# EAGLE design PQ60-EPS (EAGLE 7.3.0)
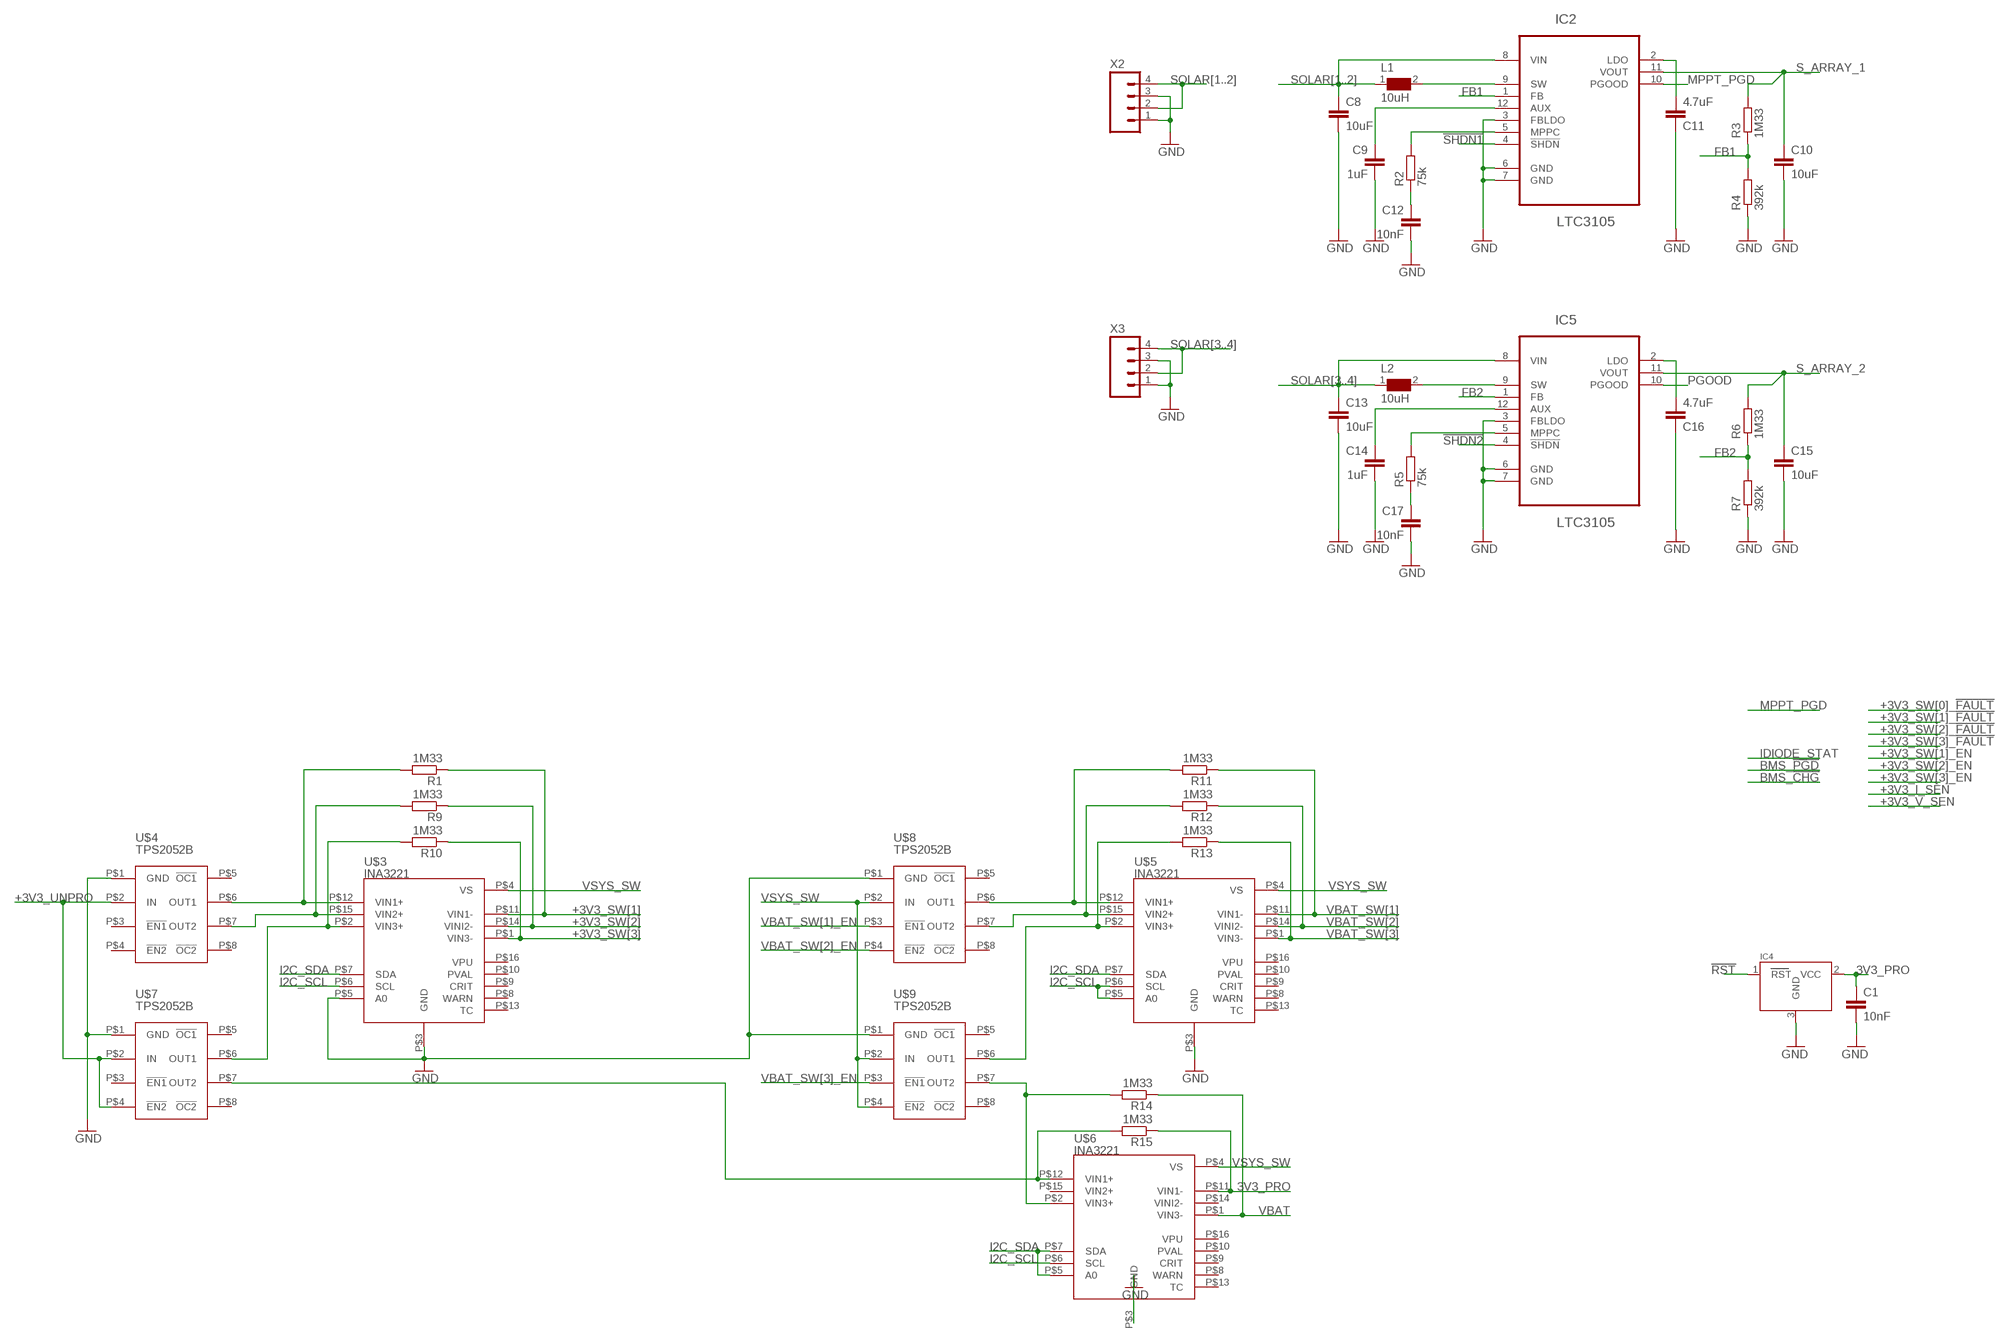
[diagram p0: schematic, sheet 1, part 1 of 2]
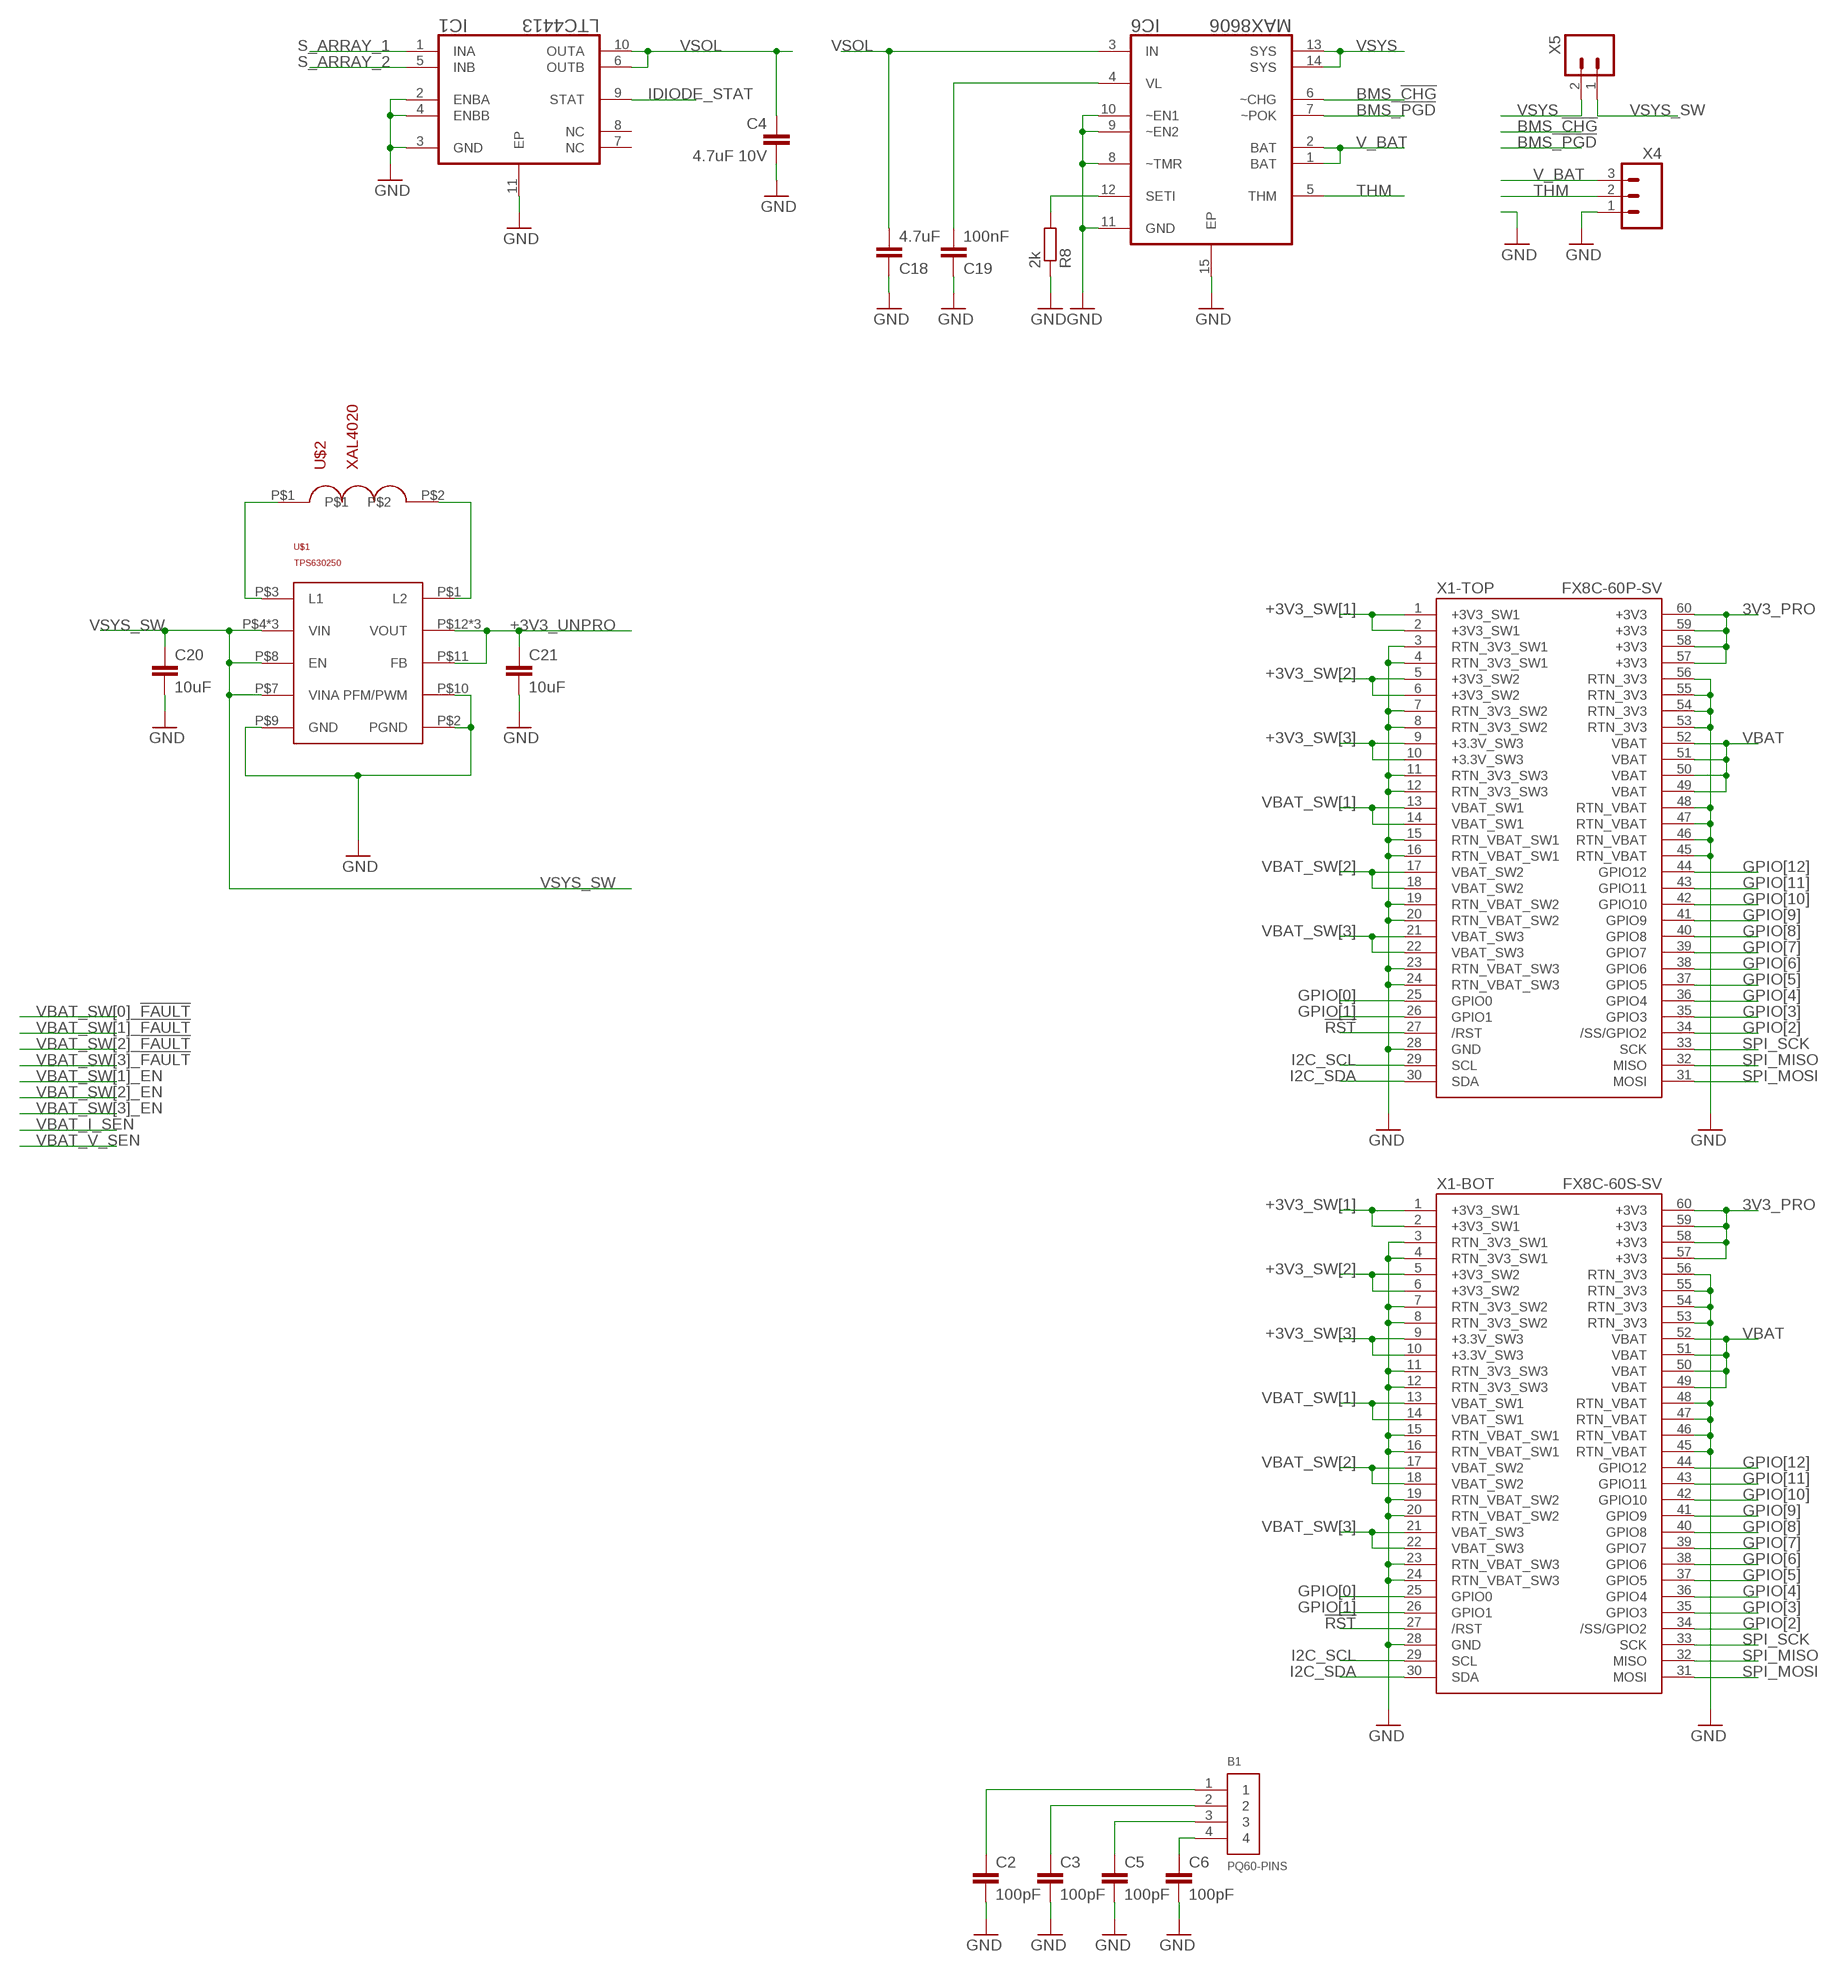
[diagram p1: schematic, sheet 1, part 2 of 2]

## Parts
B1  PQ60-PINS  [PQ60_PINS]
C1  10nF  C-EUC0603  [C0603]
C2  100pF  C-EUC0402  [C0402]
C3  100pF  C-EUC0402  [C0402]
C4  4.7uF 10V  C-EUC0805  [C0805]
C5  100pF  C-EUC0402  [C0402]
C6  100pF  C-EUC0402  [C0402]
C8  10uF  C-EUC0603  [C0603]
C9  1uF  C-EUC0603  [C0603]
C10  10uF  C-EUC0603  [C0603]
C11  4.7uF  C-EUC0603  [C0603]
C12  10nF  C-EUC0603  [C0603]
C13  10uF  C-EUC0603  [C0603]
C14  1uF  C-EUC0603  [C0603]
C15  10uF  C-EUC0603  [C0603]
C16  4.7uF  C-EUC0603  [C0603]
C17  10nF  C-EUC0603  [C0603]
C18  4.7uF  C-EUC0603  [C0603]
C19  100nF  C-EUC0603  [C0603]
C20  10uF  C-EUC0603  [C0603]
C21  10uF  C-EUC0603  [C0603]
IC1  LTC4413  LTC4413EDDPBF  [DFN300X300X80-11N]
IC2  LTC3105  LTC3105EMSPBF  [SOP65P490X110-12N]
IC4  MCP130TREFLOW  [SOT23-R]
IC5  LTC3105  LTC3105EMSPBF  [SOP65P490X110-12N]
IC6  MAX8606  MAX8606ETD+T  [DFN300X300X80-15N]
L1  10uH  WE-TPC-744031100_3816  [WE-TPC_3816]
L2  10uH  WE-TPC-744031100_3816  [WE-TPC_3816]
R1  1M33  R-EU_R0603  [R0603]
R2  75k  R-EU_R0603  [R0603]
R3  1M33  R-EU_R0603  [R0603]
R4  392k  R-EU_R0603  [R0603]
R5  75k  R-EU_R0603  [R0603]
R6  1M33  R-EU_R0603  [R0603]
R7  392k  R-EU_R0603  [R0603]
R8  2k  R-EU_R0603  [R0603]
R9  1M33  R-EU_R0603  [R0603]
R10  1M33  R-EU_R0603  [R0603]
R11  1M33  R-EU_R0603  [R0603]
R12  1M33  R-EU_R0603  [R0603]
R13  1M33  R-EU_R0603  [R0603]
R14  1M33  R-EU_R0603  [R0603]
R15  1M33  R-EU_R0603  [R0603]
U$1  TPS630250  [VQFN14]
U$2  XAL4020  [XAL4020]
U$3  INA3221  [VQFN16]
U$4  TPS2052B  [8SON]
U$5  INA3221  [VQFN16]
U$6  INA3221  [VQFN16]
U$7  TPS2052B  [8SON]
U$8  TPS2052B  [8SON]
U$9  TPS2052B  [8SON]
X1-BOT  FX8C-60S-SV  FX8C-60-R2S-SV  [FX8C-60S-SV]
X1-TOP  FX8C-60P-SV  FX8C-60-R2P-SV  [FX8C-60P-SV]
X2  M04SMD2  [1X04-1MM-RA]
X3  M04SMD2  [1X04-1MM-RA]
X4  M03SMD  [1X03-1MM-RA]
X5  M02SMD  [1X02-1MM-RA]

## Nets
3V3_PRO: C1.1 IC4.2(VCC) R15.1 U$6.P$11(VIN1-) X1-BOT.57(+3V3) X1-BOT.58(+3V3) X1-BOT.59(+3V3) X1-BOT.60(+3V3) X1-TOP.57(+3V3) X1-TOP.58(+3V3) X1-TOP.59(+3V3) X1-TOP.60(+3V3)
!RST: IC4.1(RST) X1-BOT.27(/RST) X1-TOP.27(/RST)
!SHDN1!: IC2.4(!SHDN!)
!SHDN2!: IC5.4(!SHDN!)
+3V3_SW[1]: R1.1 U$3.P$11(VIN1-) X1-BOT.1(+3V3_SW1) X1-BOT.2(+3V3_SW1) X1-TOP.1(+3V3_SW1) X1-TOP.2(+3V3_SW1)
+3V3_SW[2]: R9.1 U$3.P$14(VINI2-) X1-BOT.5(+3V3_SW2) X1-BOT.6(+3V3_SW2) X1-TOP.5(+3V3_SW2) X1-TOP.6(+3V3_SW2)
+3V3_SW[3]: R10.1 U$3.P$1(VIN3-) X1-BOT.9(+3.3V_SW3) X1-BOT.10(+3.3V_SW3) X1-TOP.9(+3.3V_SW3) X1-TOP.10(+3.3V_SW3)
+3V3_UNPRO: C21.1 U$1.P$11(FB) U$1.P$12(VOUT) U$1.P$13(VOUT) U$1.P$14(VOUT) U$4.P$2(IN) U$7.P$2(IN) U$7.P$4(!EN2!)
AUX1: C9.1 IC2.12(AUX)
AUX2: C14.1 IC5.12(AUX)
BATT_PROG: IC6.12(SETI) R8.2
BMS_!CHG!: IC6.6(~CHG)
BMS_!PGD!: IC6.7(~POK)
FB1: IC2.1(FB) R3.1 R4.2
FB2: IC5.1(FB) R6.1 R7.2
GND: C1.2 C2.2 C3.2 C4.2 C5.2 C6.2 C8.2 C9.2 C10.2 C11.1 C12.2 C13.2 C14.2 C15.2 C16.1 C17.2 C18.1 C19.1 C20.2 C21.2 IC1.2(ENBA) IC1.3(GND) IC1.4(ENBB) IC1.11(EP) IC2.3(FBLDO) IC2.6(GND) IC2.7(GND) IC4.3(GND) IC5.3(FBLDO) IC5.6(GND) IC5.7(GND) IC6.8(~TMR) IC6.9(~EN2) IC6.10(~EN1) IC6.11(GND) IC6.15(EP) R4.1 R7.1 R8.1 U$1.P$2(PGND) U$1.P$9(GND) U$1.P$10(PFM/PWM) U$3.P$3(GND) U$3.P$5(A0) U$4.P$1(GND) U$5.P$3(GND) U$6.P$3(GND) U$7.P$1(GND) U$8.P$1(GND) U$9.P$1(GND) X1-BOT.3(RTN_3V3_SW1) X1-BOT.4(RTN_3V3_SW1) X1-BOT.7(RTN_3V3_SW2) X1-BOT.8(RTN_3V3_SW2) X1-BOT.11(RTN_3V3_SW3) X1-BOT.12(RTN_3V3_SW3) X1-BOT.15(RTN_VBAT_SW1) X1-BOT.16(RTN_VBAT_SW1) X1-BOT.19(RTN_VBAT_SW2) X1-BOT.20(RTN_VBAT_SW2) X1-BOT.23(RTN_VBAT_SW3) X1-BOT.24(RTN_VBAT_SW3) X1-BOT.28(GND) X1-BOT.45(RTN_VBAT) X1-BOT.46(RTN_VBAT) X1-BOT.47(RTN_VBAT) X1-BOT.48(RTN_VBAT) X1-BOT.53(RTN_3V3) X1-BOT.54(RTN_3V3) X1-BOT.55(RTN_3V3) X1-BOT.56(RTN_3V3) X1-TOP.3(RTN_3V3_SW1) X1-TOP.4(RTN_3V3_SW1) X1-TOP.7(RTN_3V3_SW2) X1-TOP.8(RTN_3V3_SW2) X1-TOP.11(RTN_3V3_SW3) X1-TOP.12(RTN_3V3_SW3) X1-TOP.15(RTN_VBAT_SW1) X1-TOP.16(RTN_VBAT_SW1) X1-TOP.19(RTN_VBAT_SW2) X1-TOP.20(RTN_VBAT_SW2) X1-TOP.23(RTN_VBAT_SW3) X1-TOP.24(RTN_VBAT_SW3) X1-TOP.28(GND) X1-TOP.45(RTN_VBAT) X1-TOP.46(RTN_VBAT) X1-TOP.47(RTN_VBAT) X1-TOP.48(RTN_VBAT) X1-TOP.53(RTN_3V3) X1-TOP.54(RTN_3V3) X1-TOP.55(RTN_3V3) X1-TOP.56(RTN_3V3) X2.1 X2.3 X3.1 X3.3 X4.1
GPIO[0]: X1-BOT.25(GPIO0) X1-TOP.25(GPIO0)
GPIO[1]: X1-BOT.26(GPIO1) X1-TOP.26(GPIO1)
GPIO[2]: X1-BOT.34(/SS/GPIO2) X1-TOP.34(/SS/GPIO2)
GPIO[3]: X1-BOT.35(GPIO3) X1-TOP.35(GPIO3)
GPIO[4]: X1-BOT.36(GPIO4) X1-TOP.36(GPIO4)
GPIO[5]: X1-BOT.37(GPIO5) X1-TOP.37(GPIO5)
GPIO[6]: X1-BOT.38(GPIO6) X1-TOP.38(GPIO6)
GPIO[7]: X1-BOT.39(GPIO7) X1-TOP.39(GPIO7)
GPIO[8]: X1-BOT.40(GPIO8) X1-TOP.40(GPIO8)
GPIO[9]: X1-BOT.41(GPIO9) X1-TOP.41(GPIO9)
GPIO[10]: X1-BOT.42(GPIO10) X1-TOP.42(GPIO10)
GPIO[11]: X1-BOT.43(GPIO11) X1-TOP.43(GPIO11)
GPIO[12]: X1-BOT.44(GPIO12) X1-TOP.44(GPIO12)
I2C_SCL: U$3.P$6(SCL) U$5.P$5(A0) U$5.P$6(SCL) U$6.P$6(SCL) X1-BOT.29(SCL) X1-TOP.29(SCL)
I2C_SDA: U$3.P$7(SDA) U$5.P$7(SDA) U$6.P$5(A0) U$6.P$7(SDA) X1-BOT.30(SDA) X1-TOP.30(SDA)
IDIODE_STAT: IC1.9(STAT)
L1: U$1.P$3(L1) U$2.P$1
L2: U$1.P$1(L2) U$2.P$2
LDO1: C11.2 IC2.2(LDO)
LDO2: C16.2 IC5.2(LDO)
MPPC1: IC2.5(MPPC) R2.2
MPPC2: IC5.5(MPPC) R5.2
MPPT_PGD: IC2.10(PGOOD)
N$1: B1.1 C2.1
N$2: B1.2 C3.1
N$3: B1.3 C5.1
N$4: B1.4 C6.1
N$6: R1.2 U$3.P$12(VIN1+) U$4.P$6(OUT1)
N$7: R9.2 U$3.P$15(VIN2+) U$4.P$7(OUT2)
N$8: R10.2 U$3.P$2(VIN3+) U$7.P$6(OUT1)
N$9: R11.2 U$5.P$12(VIN1+) U$8.P$6(OUT1)
N$10: R12.2 U$5.P$15(VIN2+) U$8.P$7(OUT2)
N$11: R13.2 U$5.P$2(VIN3+) U$9.P$6(OUT1)
N$12: R14.2 U$6.P$2(VIN3+) U$9.P$7(OUT2)
N$13: R15.2 U$6.P$12(VIN1+) U$7.P$7(OUT2)
PGOOD: IC5.10(PGOOD)
S_ARRAY_1: C10.1 IC1.1(INA) IC2.11(VOUT) R3.2
S_ARRAY_2: C15.1 IC1.5(INB) IC5.11(VOUT) R6.2
SOLAR[1..2]: C8.1 IC2.8(VIN) L1.1 X2.2 X2.4
SOLAR[3..4]: C13.1 IC5.8(VIN) L2.1 X3.2 X3.4
SPI_MISO: X1-BOT.32(MISO) X1-TOP.32(MISO)
SPI_MOSI: X1-BOT.31(MOSI) X1-TOP.31(MOSI)
SPI_SCK: X1-BOT.33(SCK) X1-TOP.33(SCK)
SW1: IC2.9(SW) L1.2
SW2: IC5.9(SW) L2.2
THM: IC6.5(THM) X4.2
THM1: C12.1 R2.1
THM2: C17.1 R5.1
V_BAT: IC6.1(BAT) IC6.2(BAT) X4.3
VBAT: R14.1 U$6.P$1(VIN3-) X1-BOT.49(VBAT) X1-BOT.50(VBAT) X1-BOT.51(VBAT) X1-BOT.52(VBAT) X1-TOP.49(VBAT) X1-TOP.50(VBAT) X1-TOP.51(VBAT) X1-TOP.52(VBAT)
VBAT_SW[1]: R11.1 U$5.P$11(VIN1-) X1-BOT.13(VBAT_SW1) X1-BOT.14(VBAT_SW1) X1-TOP.13(VBAT_SW1) X1-TOP.14(VBAT_SW1)
VBAT_SW[1]_EN: U$8.P$3(!EN1!)
VBAT_SW[2]: R12.1 U$5.P$14(VINI2-) X1-BOT.17(VBAT_SW2) X1-BOT.18(VBAT_SW2) X1-TOP.17(VBAT_SW2) X1-TOP.18(VBAT_SW2)
VBAT_SW[2]_EN: U$8.P$4(!EN2!)
VBAT_SW[3]: R13.1 U$5.P$1(VIN3-) X1-BOT.21(VBAT_SW3) X1-BOT.22(VBAT_SW3) X1-TOP.21(VBAT_SW3) X1-TOP.22(VBAT_SW3)
VBAT_SW[3]_EN: U$9.P$3(!EN1!)
VL: C19.2 IC6.4(VL)
VSOL: C4.1 C18.2 IC1.6(OUTB) IC1.10(OUTA) IC6.3(IN)
VSYS: IC6.13(SYS) IC6.14(SYS) X5.2
VSYS_SW: C20.1 U$1.P$4(VIN) U$1.P$5(VIN) U$1.P$6(VIN) U$1.P$7(VINA) U$1.P$8(EN) U$3.P$4(VS) U$5.P$4(VS) U$6.P$4(VS) U$8.P$2(IN) U$9.P$2(IN) U$9.P$4(!EN2!) X5.1
Unconnected: IC1.7(NC) IC1.8(NC) U$3.P$8(WARN) U$3.P$9(CRIT) U$3.P$10(PVAL) U$3.P$13(TC) U$3.P$16(VPU) U$4.P$3(!EN1!) U$4.P$4(!EN2!) U$4.P$5(!OC1!) U$4.P$8(!OC2!) U$5.P$8(WARN) U$5.P$9(CRIT) U$5.P$10(PVAL) U$5.P$13(TC) U$5.P$16(VPU) U$6.P$8(WARN) U$6.P$9(CRIT) U$6.P$10(PVAL) U$6.P$13(TC) U$6.P$14(VINI2-) U$6.P$15(VIN2+) U$6.P$16(VPU) U$7.P$3(!EN1!) U$7.P$5(!OC1!) U$7.P$8(!OC2!) U$8.P$5(!OC1!) U$8.P$8(!OC2!) U$9.P$5(!OC1!) U$9.P$8(!OC2!)

## Library data of the parts
B1 = general:PQ60-PINS; OC_FARNELL: unknown
C1 C4 C8 C10-C13 C15-C21 = rcl:C-EU: CAPACITOR, European symbol; OC_FARNELL: unknown
C2 C3 C5 C6 = rcl:C-EU: CAPACITOR, European symbol; MF: AVX; MPN: 02013A101JAT2A; OC_FARNELL: 2280754
C9 C14 = rcl:C-EU: CAPACITOR, European symbol; MF: AVX; MPN: 02016D105MAT2A; OC_FARNELL: 1867951RL
IC1 = general:LTC4413EDDPBF: Dual 2.6A, 2.5V to 5.5V, Ideal Diodes; MF: LINEAR TECHNOLOGY; MPN: LTC4413EDD#PBF; OC_FARNELL: 1663736; OC_NEWARK: 56M9529; PACKAGE: DFN-10; SUPPLIER: Linear Technology
IC2 IC5 = general:LTC3105EMSPBF: DC/DC Converter; MF: LINEAR TECHNOLOGY; MPN: LTC3105EMS#PBF; OC_FARNELL: 1898601; OC_NEWARK: 27T5811; PACKAGE: MSOP-12; SUPPLIER: Linear Technology
IC4 = microbuilder:MCP130T: MCP130T Voltage Supervisor (Active Low) Voltage supervisors will put the MCU in a reset state if the voltage drops below a pre-determined level. SOT23-R/SOT23-W: Voltage Supervisor - 3.15V Active Low Note: Use the "Reflow" footprint when working with solder paste, and the "Wave" footprint when soldering by hand with a soldering iron (the latter has larger pads that are easier to solder by hand). Digikey: MCP130T-315I/TTCT-ND; OC_FARNELL: unknown
IC6 = general:MAX8606ETD+T: USB/AC Adapter, Li+ Linear Battery Charger with Integrated 50mÙ Battery Switch; MF: MAXIM INTEGRATED PRODUCTS; MPN: MAX8606ETD+T; OC_FARNELL: 1628234; OC_NEWARK: 68K5050; PACKAGE: DFN-14; SUPPLIER: Maxim
L1 L2 = WE-TPC:WE-TPC: Shielded Tiny Power Inductor WE-TPC - Extremely flat power inductor - High current capability - High reliability and perfect soldering characteristics because of integrated soldering pad - magnetically shielded -- Portable power like PDA, digital camera, PCMICA-cards and displays -- DC/DC-converter -- Recommended for switching regulator IC's from Linear Technology, National Semiconductor, Texas Instruments and Fairchild Semiconductor; MF: WURTH ELEKTRONIK; MPN: 744031100; OC_FARNELL: 1635835; OC_NEWARK: 08P2474; PACKAGE: 3816; SUPPLIER: WURTH ELEKTRONIK
R1-R15 = rcl:R-EU_: RESISTOR, European symbol; OC_FARNELL: unknown
U$1 = ears-pq:TPS630250
U$2 = ears-pq:XAL4020
U$3 U$5 U$6 = ears-pq:INA3221
U$4 U$7-U$9 = ears-pq:TPS2052B
X1-BOT X1-TOP = PQ60:FX8C-60-R2; OC_FARNELL: unknown
X2 X3 = SparkFun-Connectors:M04: Header 4 Standard 4-pin 0.1" header. Use with straight break away headers (SKU : PRT-00116), right angle break away headers (PRT-00553), swiss pins (PRT-00743), machine pins (PRT-00117), and female headers (PRT-00115). Molex polarized connector foot print use with SKU : PRT-08231 with associated crimp pins and housings. 1MM SMD Version SKU: PRT-10208; OC_FARNELL: unknown
X4 = SparkFun-Connectors:M03: Header 3 Standard 3-pin 0.1" header. Use with straight break away headers (SKU : PRT-00116), right angle break away headers (PRT-00553), swiss pins (PRT-00743), machine pins (PRT-00117), and female headers (PRT-00115). Molex polarized connector foot print use with SKU : PRT-08232 with associated crimp pins and housings.; OC_FARNELL: unknown
X5 = SparkFun-Connectors:M02: Standard 2-pin 0.1" header. Use with - straight break away headers ( PRT-00116) - right angle break away headers (PRT-00553) - swiss pins (PRT-00743) - machine pins (PRT-00117) - female headers (PRT-00115) Molex polarized connector foot print use with: PRT-08233 with associated crimp pins and housings. 2.54_SCREWTERM for use with PRT-10571. 3.5mm Screw Terminal footprints for PRT-08084 5mm Screw Terminal footprints for use with PRT-08432; OC_FARNELL: unknown

## Module MPPT
Ports: GND(pwr) VOUT(out) VIN(in) THM(in) PGOOD(out) !SHDN!(in)
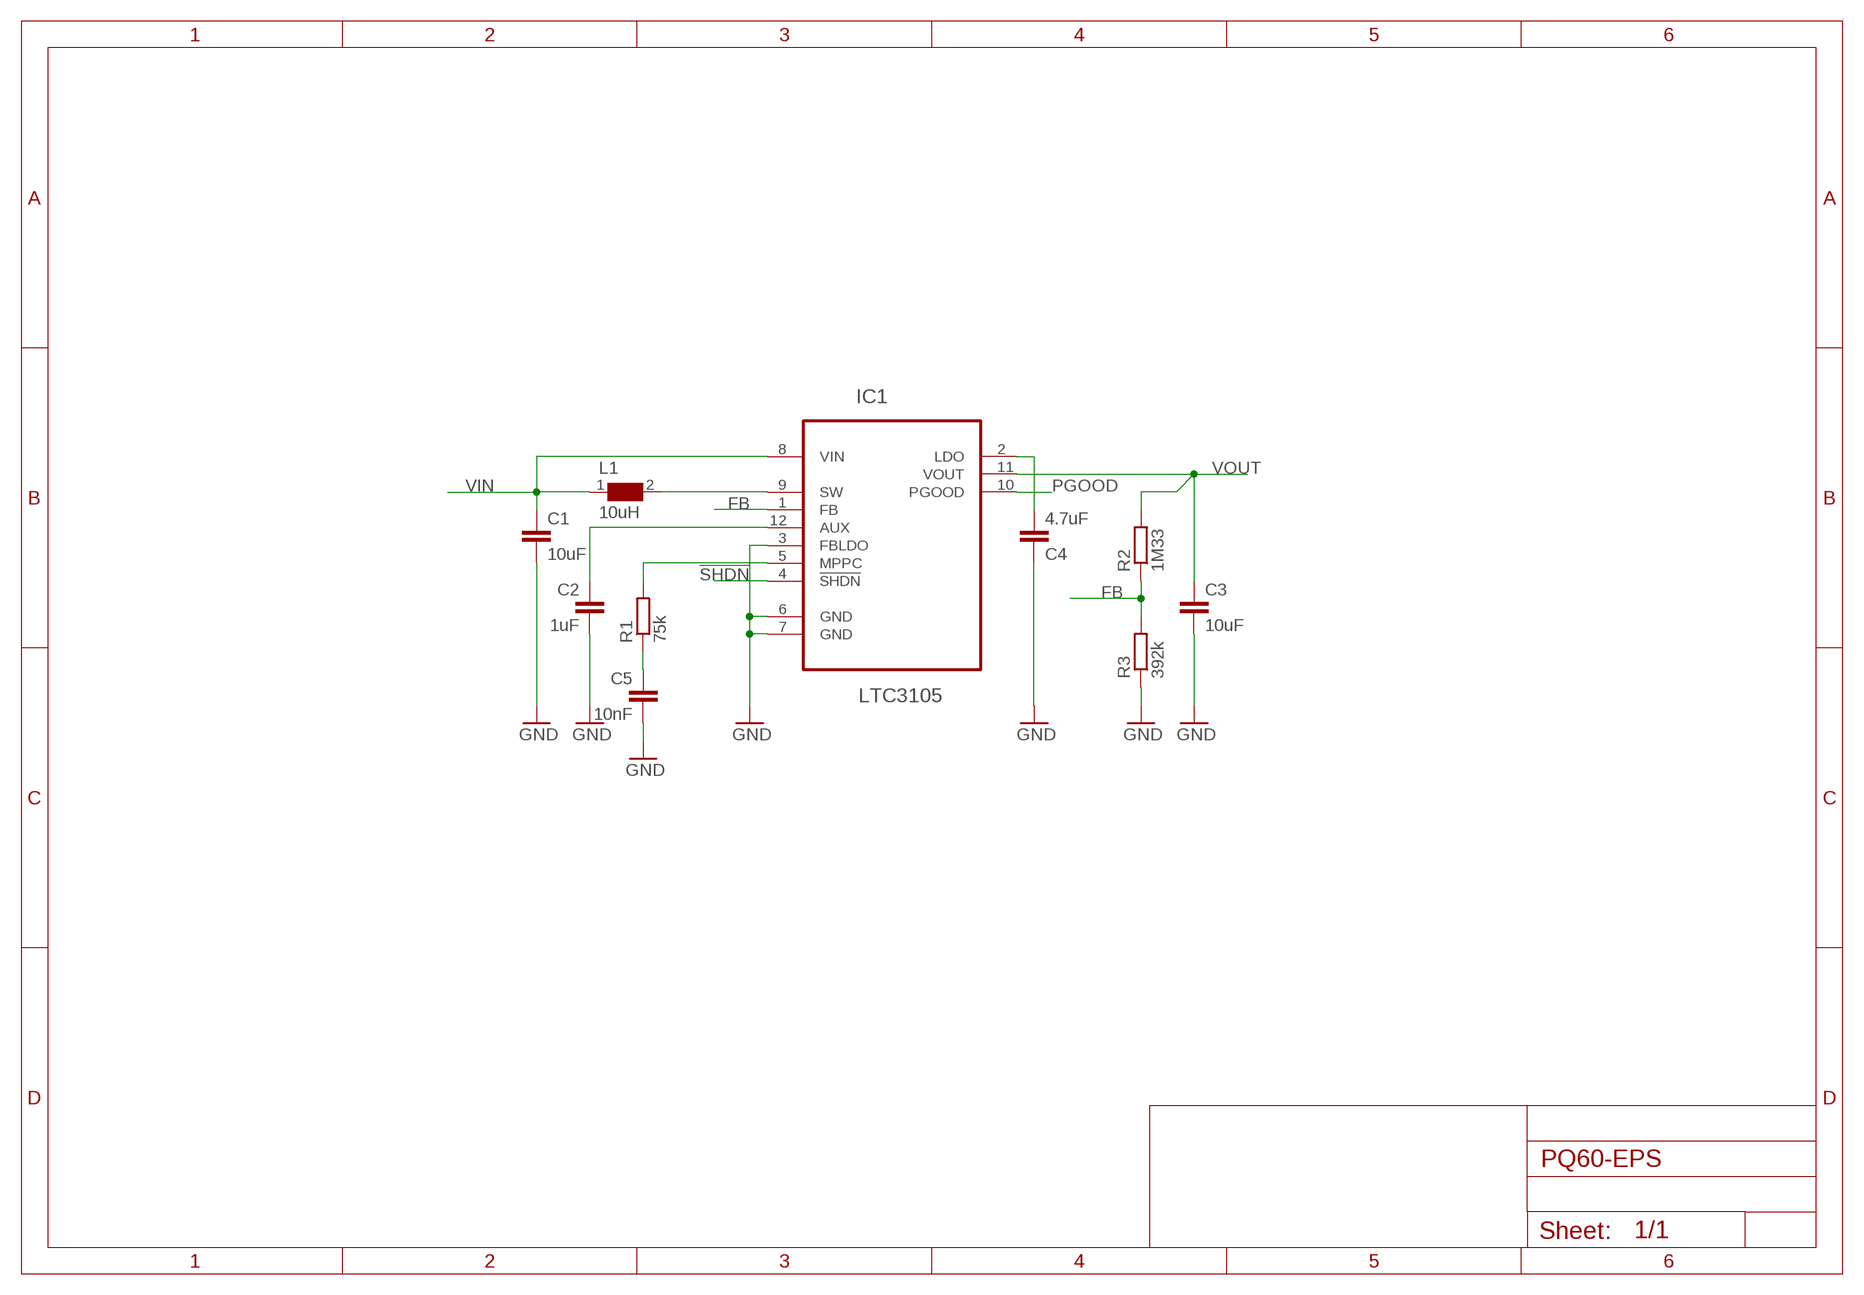
[diagram p2: schematic, module MPPT, sheet 1]

### Parts
C1  10uF  C-EUC0603  [C0603]
C2  1uF  C-EUC0603  [C0603]
C3  10uF  C-EUC0603  [C0603]
C4  4.7uF  C-EUC0603  [C0603]
C5  10nF  C-EUC0603  [C0603]
IC1  LTC3105  LTC3105EMSPBF  [SOP65P490X110-12N]
L1  10uH  WE-TPC-744031100_3816  [WE-TPC_3816]
R1  75k  R-EU_R0603  [R0603]
R2  1M33  R-EU_R0603  [R0603]
R3  392k  R-EU_R0603  [R0603]

### Nets
!SHDN!: IC1.4(!SHDN!)
AUX: C2.1 IC1.12(AUX)
FB: IC1.1(FB) R2.1 R3.2
GND: C1.2 C2.2 C3.2 C4.1 C5.2 IC1.3(FBLDO) IC1.6(GND) IC1.7(GND) R3.1
LDO: C4.2 IC1.2(LDO)
MPPC: IC1.5(MPPC) R1.2
PGOOD: IC1.10(PGOOD)
SW: IC1.9(SW) L1.2
THM: C5.1 R1.1
VIN: C1.1 IC1.8(VIN) L1.1
VOUT: C3.1 IC1.11(VOUT) R2.2

### Library data of the parts
C1 C3-C5 = rcl:C-EU: CAPACITOR, European symbol; OC_FARNELL: unknown
C2 = rcl:C-EU: CAPACITOR, European symbol; MF: AVX; MPN: 02016D105MAT2A; OC_FARNELL: 1867951RL
IC1 = general:LTC3105EMSPBF: DC/DC Converter; MF: LINEAR TECHNOLOGY; MPN: LTC3105EMS#PBF; OC_FARNELL: 1898601; OC_NEWARK: 27T5811; PACKAGE: MSOP-12; SUPPLIER: Linear Technology
L1 = WE-TPC:WE-TPC: Shielded Tiny Power Inductor WE-TPC - Extremely flat power inductor - High current capability - High reliability and perfect soldering characteristics because of integrated soldering pad - magnetically shielded -- Portable power like PDA, digital camera, PCMICA-cards and displays -- DC/DC-converter -- Recommended for switching regulator IC's from Linear Technology, National Semiconductor, Texas Instruments and Fairchild Semiconductor; MF: WURTH ELEKTRONIK; MPN: 744031100; OC_FARNELL: 1635835; OC_NEWARK: 08P2474; PACKAGE: 3816; SUPPLIER: WURTH ELEKTRONIK
R1-R3 = rcl:R-EU_: RESISTOR, European symbol; OC_FARNELL: unknown

## Module SMPS
Ports: VIN(in) VOUT(out) GND(pwr) !SHDN(in)
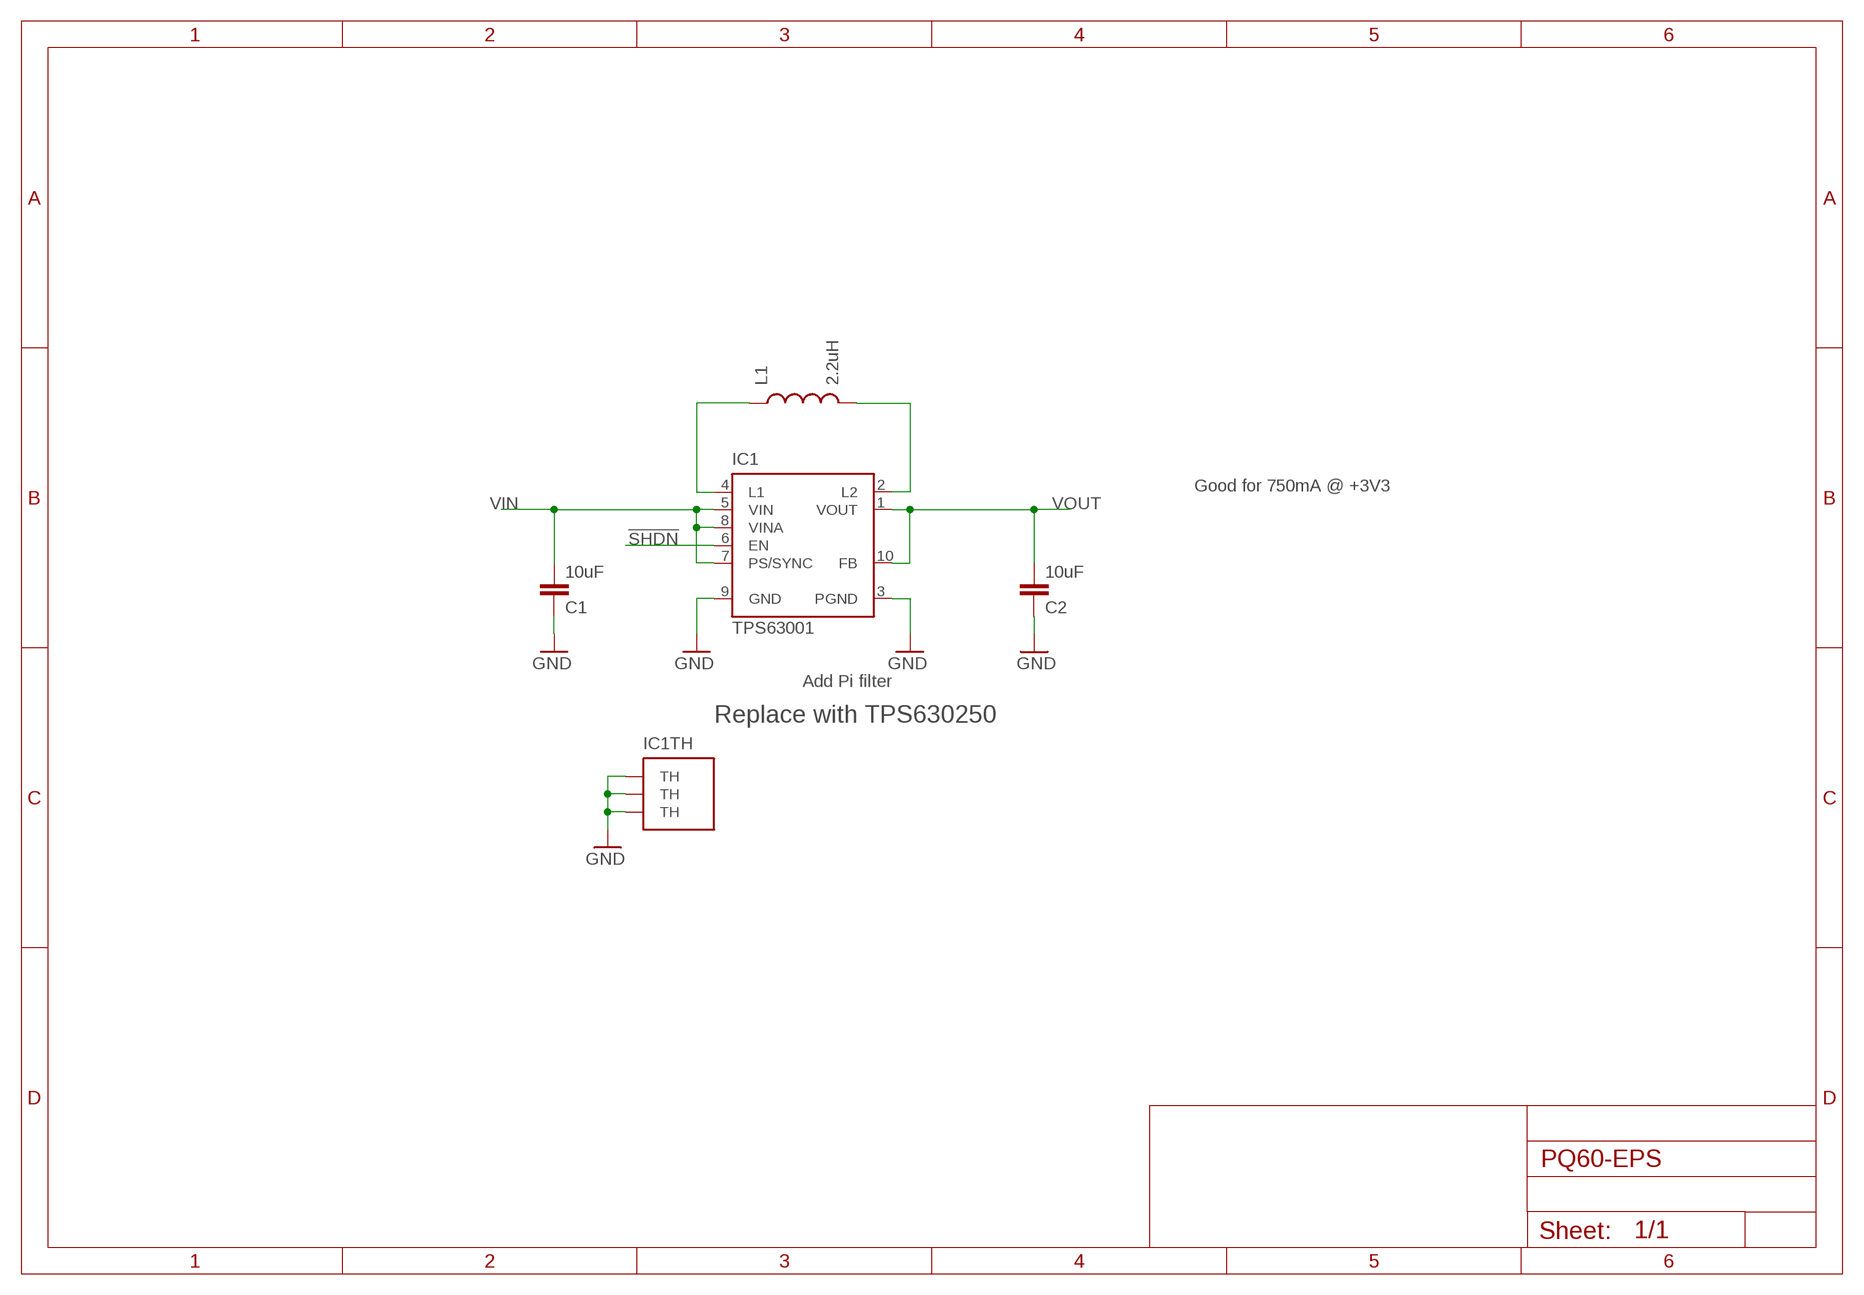
[diagram p3: schematic, module SMPS, sheet 1]

### Parts
C1  10uF  C-EUC0805  [C0805]
C2  10uF  C-EUC0805  [C0805]
IC1  TPS63001  TPS6300  [DRC-S-PVSON-N10]
L1  2.2uH  INDUCTORVLF4012A  [VLF4012A]

### Nets
!SHDN: IC1.6(EN)
GND: C1.1 C2.1 IC1.3(PGND) IC1.9(GND) IC1.TH IC1.TH@1(TH) IC1.TH@2(TH)
N$1: IC1.4(L1) L1.P$1
N$2: IC1.2(L2) L1.P$2
VIN: C1.2 IC1.5(VIN) IC1.7(PS/SYNC) IC1.8(VINA)
VOUT: C2.2 IC1.1(VOUT) IC1.10(FB)

### Notes on the sheet
- Good for 750mA @ +3V3
- Add Pi filter
- Replace with TPS630250

### Library data of the parts
C1 C2 = rcl:C-EU: CAPACITOR, European symbol; OC_FARNELL: unknown
IC1 = texas:TPS6300*: HIGH EFFICIENT SINGLE INDUCTOR BUCK-BOOST CONVERTER WITH 1.8-A SWITCHES Source: http://focus.ti.com/lit/ds/symlink/tps63001.pdf; MF: TEXAS INSTRUMENTS; MPN: TPS63001DRCT; OC_FARNELL: 1652399
L1 = SparkFun-Passives:INDUCTOR: Inductors Basic Inductor/Choke - 0603 and 1206. Footprints are not proven and vary greatly between part numbers. SRN6045- 33uH, 20% 1.4A SDR0403-560KL - 56uH, 10%, 500mA RMS/740mA peak; MF: TDK; MPN: VLF4012AT-2R2M1R5; OC_FARNELL: 1670126

## Module IDIODE
Ports: GND(pwr) VOUT(out) STAT1(out) STAT2(out) VIN1(in) VIN2(in) VIN3(in) VIN4(in)

### Library data of the parts

## Module BMS
Ports: GND(pwr) VIN(in) VOUT(out) VBAT(out) THM(in) !CHG(out) !PGD(out)
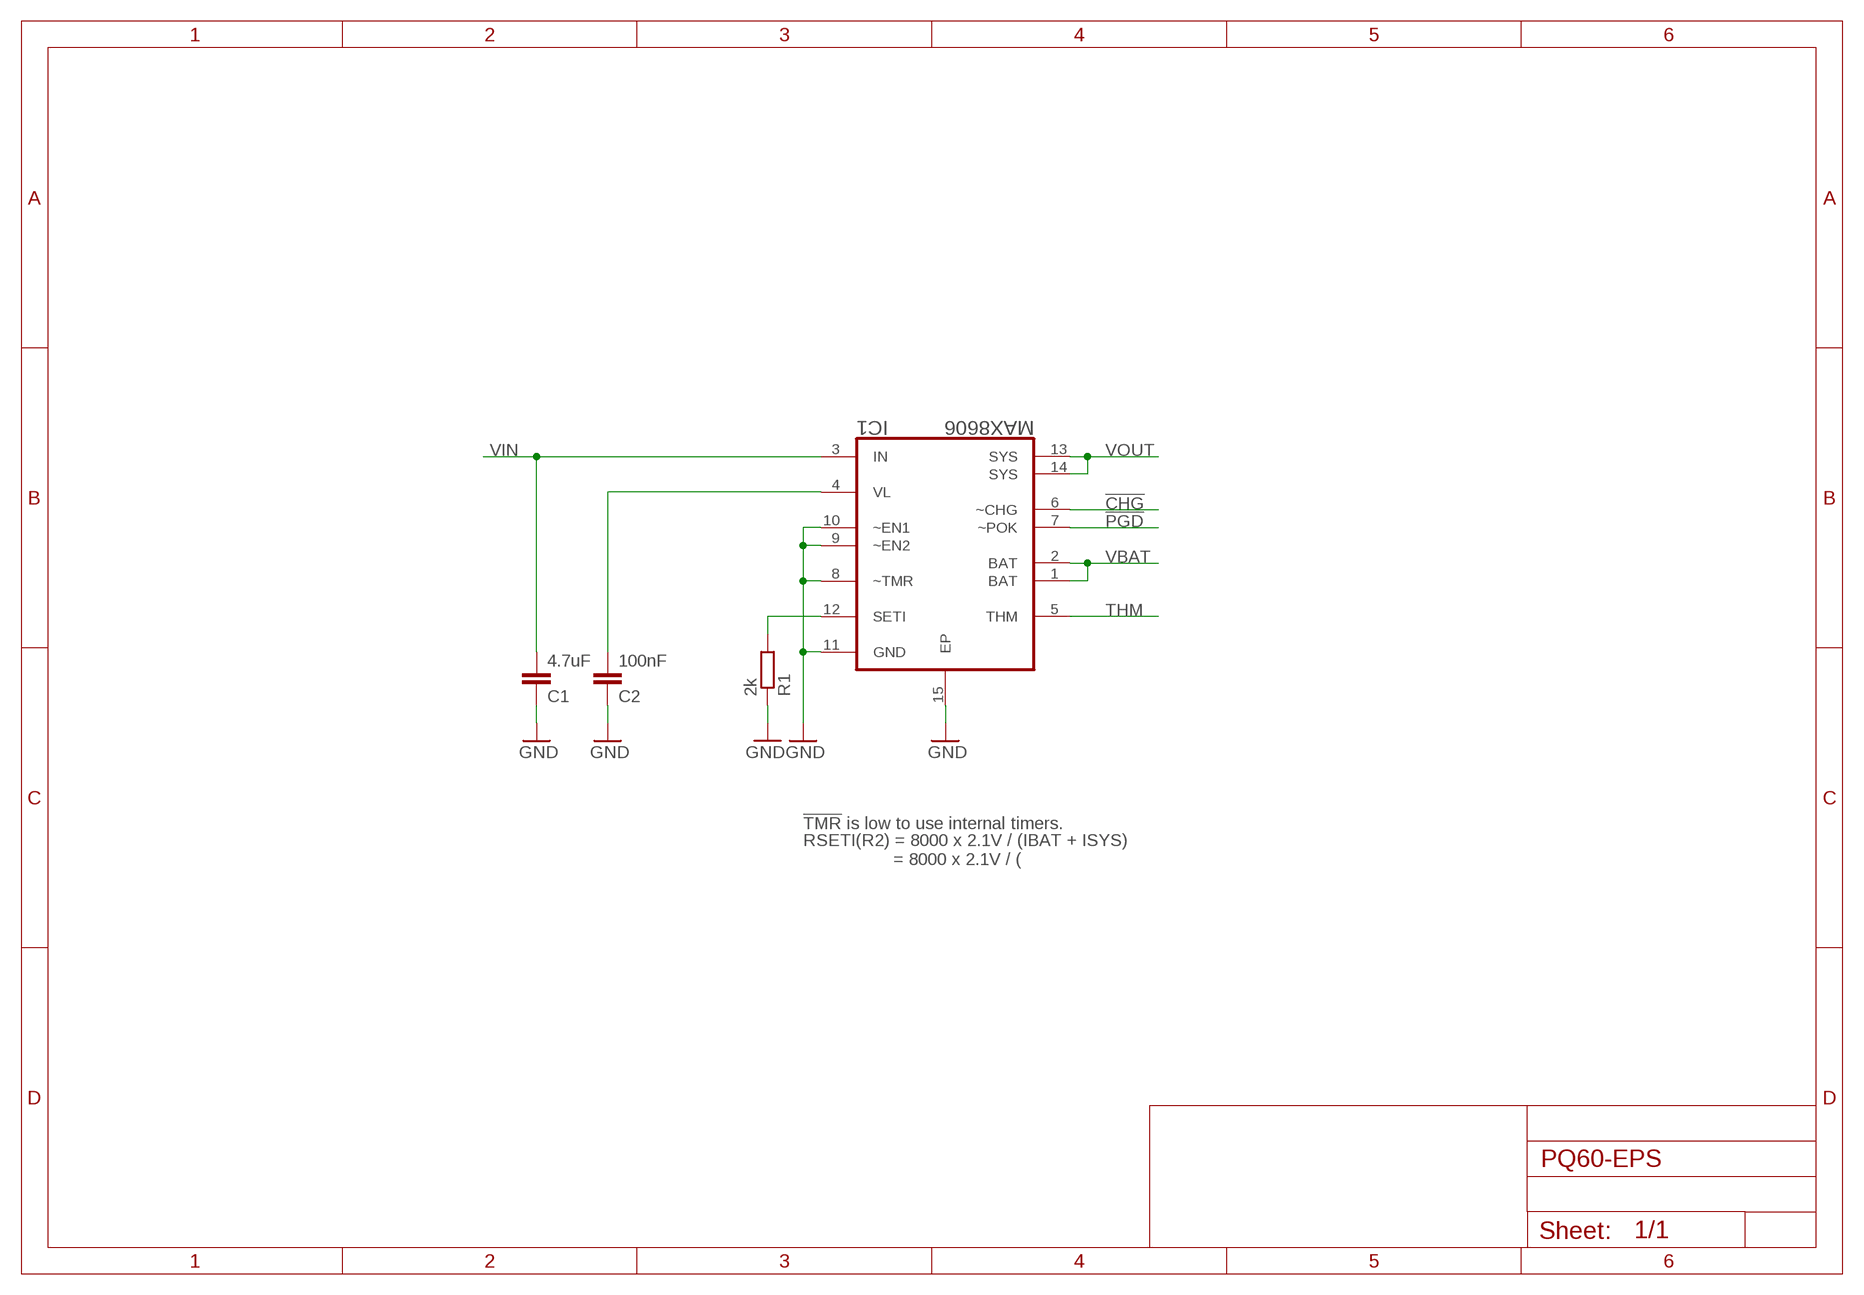
[diagram p4: schematic, module BMS, sheet 1]

### Parts
C1  4.7uF  C-EUC0603  [C0603]
C2  100nF  C-EUC0603  [C0603]
IC1  MAX8606  MAX8606ETD+T  [DFN300X300X80-15N]
R1  2k  R-EU_R0603  [R0603]

### Nets
!CHG: IC1.6(~CHG)
!PGD: IC1.7(~POK)
BATT_PROG: IC1.12(SETI) R1.2
GND: C1.1 C2.1 IC1.8(~TMR) IC1.9(~EN2) IC1.10(~EN1) IC1.11(GND) IC1.15(EP) R1.1
THM: IC1.5(THM)
VBAT: IC1.1(BAT) IC1.2(BAT)
VIN: C1.2 IC1.3(IN)
VL: C2.2 IC1.4(VL)
VOUT: IC1.13(SYS) IC1.14(SYS)

### Notes on the sheet
- !TMR! is low to use internal timers.
- RSETI(R2) = 8000 x 2.1V / (IBAT + ISYS)
                    = 8000 x 2.1V / (

### Library data of the parts
C1 C2 = rcl:C-EU: CAPACITOR, European symbol; OC_FARNELL: unknown
IC1 = general:MAX8606ETD+T: USB/AC Adapter, Li+ Linear Battery Charger with Integrated 50mÙ Battery Switch; MF: MAXIM INTEGRATED PRODUCTS; MPN: MAX8606ETD+T; OC_FARNELL: 1628234; OC_NEWARK: 68K5050; PACKAGE: DFN-14; SUPPLIER: Maxim
R1 = rcl:R-EU_: RESISTOR, European symbol; OC_FARNELL: unknown

## Module PROT
Ports: IN(in) OUT(out) V_SEN(out) I_SEN(out) GND(pwr) OUT_!FAULT!(out) SW1_!FAULT!(out) SW2_!FAULT!(out) SW3_!FAULT!(out) OUT_SW1(out) OUT_SW2(out) OUT_SW3(out) SW1_EN(in) SW2_EN(in) SW3_EN(in)
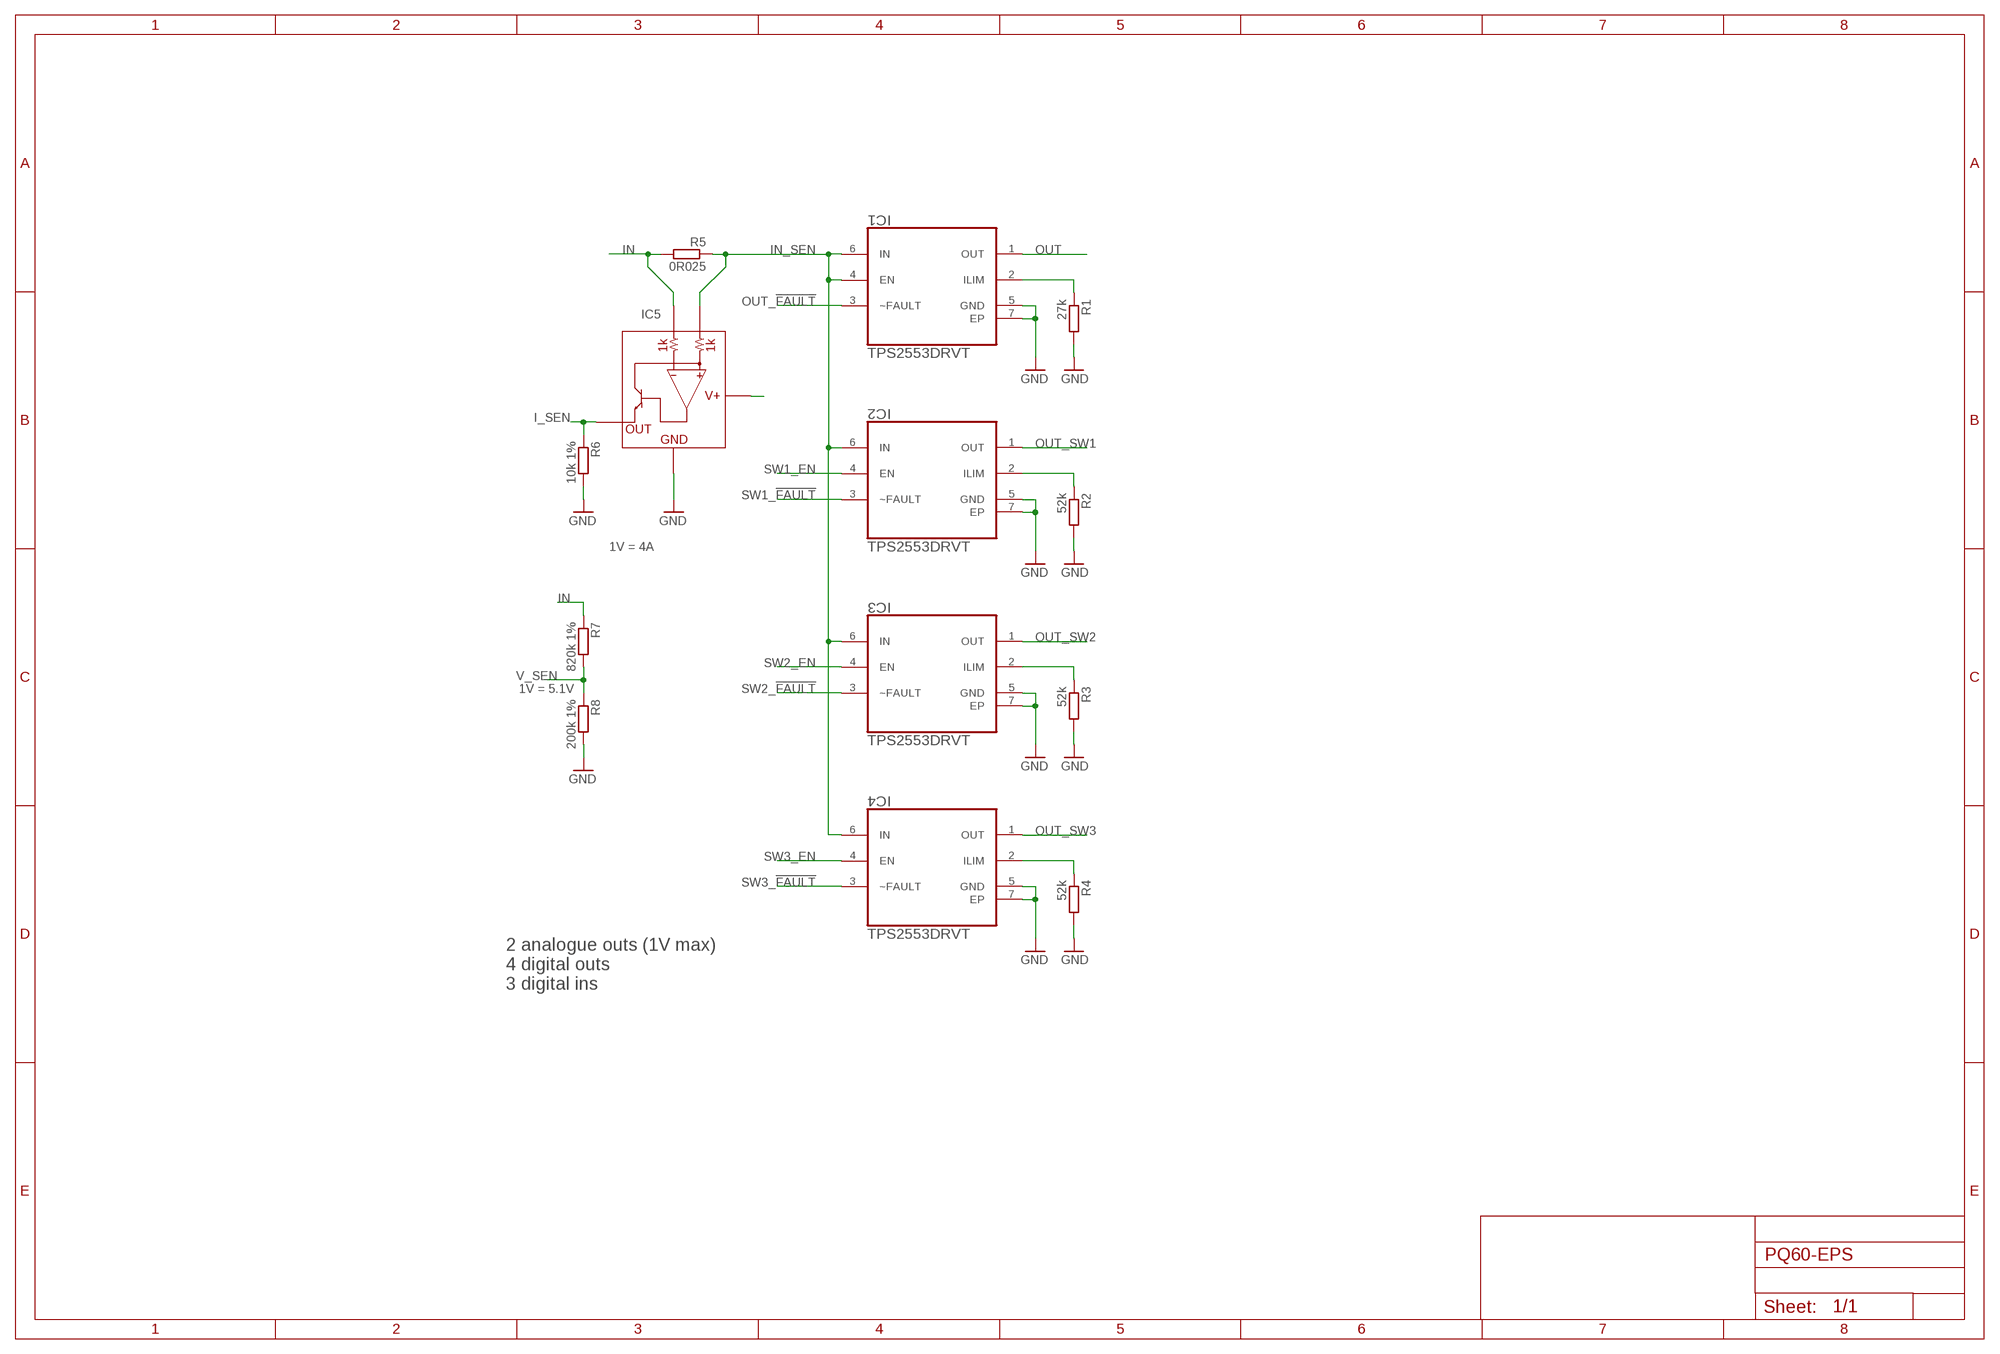
[diagram p5: schematic, module PROT, sheet 1]

### Parts
IC1  TPS2553DRVT  [SON65P200X200X80-7N]
IC2  TPS2553DRVT  [SON65P200X200X80-7N]
IC3  TPS2553DRVT  [SON65P200X200X80-7N]
IC4  TPS2553DRVT  [SON65P200X200X80-7N]
IC5  INA139  [SOT23-5]
R1  27k  R-EU_R0603  [R0603]
R2  52k  R-EU_R0603  [R0603]
R3  52k  R-EU_R0603  [R0603]
R4  52k  R-EU_R0603  [R0603]
R5  0R025  R-EU_R1206  [R1206]
R6  10k 1%  R-EU_R0603  [R0603]
R7  820k 1%  R-EU_R0603  [R0603]
R8  200k 1%  R-EU_R0603  [R0603]

### Nets
GND: IC1.5(GND) IC1.7(EP) IC2.5(GND) IC2.7(EP) IC3.5(GND) IC3.7(EP) IC4.5(GND) IC4.7(EP) IC5.2(GND) R1.2 R2.2 R3.2 R4.2 R6.2 R8.2
I_LIM_SW1: IC2.2(ILIM) R2.1
I_LIM_SW2: IC3.2(ILIM) R3.1
I_LIM_SW3: IC4.2(ILIM) R4.1
I_LIM_VCC: IC1.2(ILIM) R1.1
I_SEN: IC5.1(OUT) R6.1
IN: IC5.4(VIN-) IC5.5(V+) R5.2 R7.1
IN_SEN: IC1.4(EN) IC1.6(IN) IC2.6(IN) IC3.6(IN) IC4.6(IN) IC5.3(VIN+) R5.1
OUT: IC1.1(OUT)
OUT_!FAULT!: IC1.3(~FAULT)
OUT_SW1: IC2.1(OUT)
OUT_SW2: IC3.1(OUT)
OUT_SW3: IC4.1(OUT)
SW1_!FAULT!: IC2.3(~FAULT)
SW1_EN: IC2.4(EN)
SW2_!FAULT!: IC3.3(~FAULT)
SW2_EN: IC3.4(EN)
SW3_!FAULT!: IC4.3(~FAULT)
SW3_EN: IC4.4(EN)
V_SEN: R7.2 R8.1

### Notes on the sheet
- 1V = 4A
- 1V = 5.1V
- 2 analogue outs (1V max)
  4 digital outs
  3 digital ins

### Library data of the parts
IC1-IC4 = general:TPS2553DRVT: POWER-DISTRIBUTION SWITCHES; MF: TEXAS INSTRUMENTS; MPN: TPS2553DRVT; OC_FARNELL: 1694427; OC_NEWARK: 40P3872; PACKAGE: SON-6; SUPPLIER: TEXAS INSTRUMENTS
IC5 = SparkFun-AnalogIC:INA139: High-side shunt current sense 2.7V-40V, 1%; OC_FARNELL: unknown
R1-R8 = rcl:R-EU_: RESISTOR, European symbol; OC_FARNELL: unknown

## Board
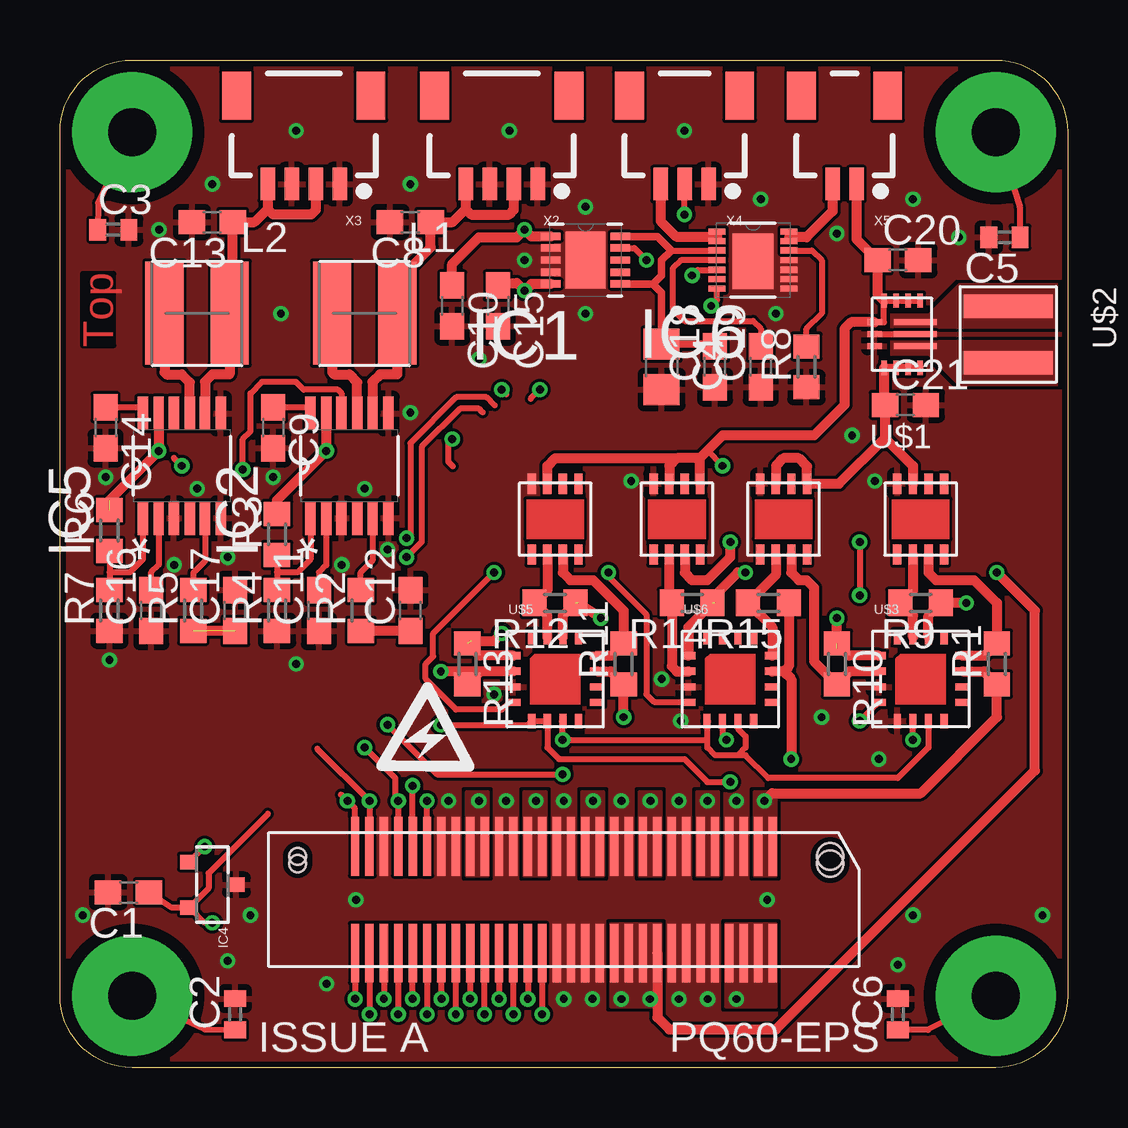
[diagram p6: board, top side]
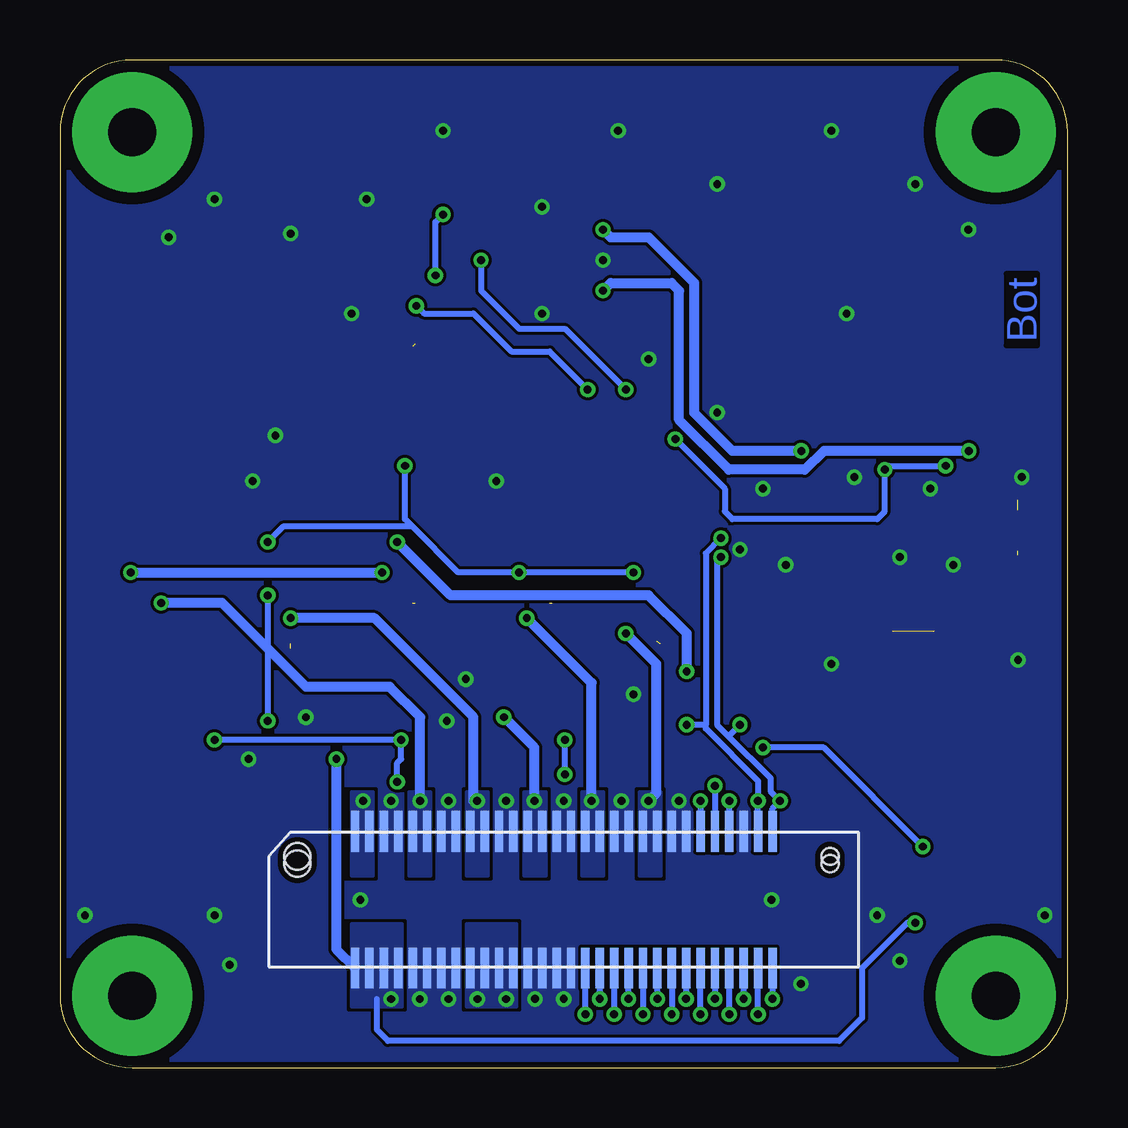
[diagram p7: board, bottom side, seen from below]

Size 42 x 42 mm. Coordinates in mm from the lower left corner, seen from the top.
Copper layers (1*16): Top 0.035mm / dielectric 1.5mm / Bottom 0.035mm
Design rules "dirt_cheap_dirty_boards.v1": minimum track width 5mil, minimum drill 12mil, track to track 5mil, track to pad 5mil, pad to pad 5mil, via to via 5mil, smd to smd 0mil, copper to edge 10mil, drill to drill 10mil, minimum pad ring 10mil, minimum via ring 6mil, stop-mask expansion 2mil, vias tented up to drill 25mil, thermal gap 10mil

### Footprints (pad centres in the part's own frame; a part is rotated, then mirrored left to right if it is on the bottom)
PQ60_PINS = drill 2 pad 5: 1 3,3; 2 3,39; 3 39,39; 4 39,3
C0603 = smd 1.1 x 1: 1 -0.85,0; 2 0.85,0
C0402 = smd 0.7 x 0.9: 1 -0.65,0; 2 0.65,0
C0805 = smd 1.3 x 1.5: 1 -0.95,0; 2 0.95,0
DFN300X300X80-11N = smd 0.813 x 0.305: 1 -1.448,0.991; 2 -1.448,0.508; 3 -1.448,0; 4 -1.448,-0.508; 5 -1.448,-0.991; 6 1.448,-0.991; 7 1.448,-0.508; 8 1.448,0; 9 1.448,0.508; 10 1.448,0.991 | smd 1.651 x 2.388: 11 0,0
SOP65P490X110-12N = smd 1.397 x 0.432: 1 -2.184,1.626; 2 -2.184,0.965; 3 -2.184,0.33; 4 -2.184,-0.33; 5 -2.184,-0.965; 6 -2.184,-1.626; 7 2.184,-1.626; 8 2.184,-0.965; 9 2.184,-0.33; 10 2.184,0.33; 11 2.184,0.965; 12 2.184,1.626
SOT23-R = smd 0.6 x 0.7: 1 -0.95,-1; 2 0.95,-1; 3 0,1
DFN300X300X80-15N = smd 0.711 x 0.254: 1 -1.499,1.194; 2 -1.499,0.787; 3 -1.499,0.406; 4 -1.499,0; 5 -1.499,-0.406; 6 -1.499,-0.787; 7 -1.499,-1.194; 8 1.499,-1.194; 9 1.499,-0.787; 10 1.499,-0.406; 11 1.499,0; 12 1.499,0.406; 13 1.499,0.787; 14 1.499,1.194 | smd 1.702 x 2.311: 15 0,-0.051
WE-TPC_3816 = smd 1.6 x 4.3: 1 -1.356,-0.014; 2 1.356,-0.014
R0603 = smd 1 x 1.1: 1 -0.85,0; 2 0.85,0
VQFN14 = smd 1.79 x 0.24: P$1 0.695,2; P$2 0.695,1.5; P$3 0.695,1 | smd 0.24 x 0.6: P$4 0.5,0.1; P$5 1,0.1; P$6 1.5,0.1; P$7 2,0.1; P$11 2,2.9; P$12 1.5,2.9; P$13 1,2.9; P$14 0.5,2.9 | smd 0.6 x 0.24: P$8 2.4,1; P$9 2.4,1.5; P$10 2.4,2
XAL4020 = smd 0.98 x 3.7: P$1 -1.175,0; P$2 1.175,0
VQFN16 = smd 0.6 x 0.3: P$1 -1.75,0.975; P$2 -1.75,0.325; P$3 -1.75,-0.325; P$4 -1.75,-0.975; P$9 1.75,-0.975; P$10 1.75,-0.325; P$11 1.75,0.325; P$12 1.75,0.975 | smd 0.3 x 0.6: P$5 -0.975,-1.75; P$6 -0.325,-1.75; P$7 0.325,-1.75; P$8 0.975,-1.75; P$13 0.975,1.75; P$14 0.325,1.75; P$15 -0.325,1.75; P$16 -0.975,1.75
8SON = smd 0.35 x 0.85: P$1 -0.975,1.475; P$2 -0.325,1.475; P$3 0.325,1.475; P$4 0.975,1.475; P$5 0.975,-1.475; P$6 0.325,-1.475; P$7 -0.325,-1.475; P$8 -0.975,-1.475
FX8C-60S-SV = smd 0.35 x 1.7: 1 -8.7,2.85; 2 -8.1,2.85; 3 -7.5,2.85; 4 -6.9,2.85; 5 -6.3,2.85; 6 -5.7,2.85; 7 -5.1,2.85; 8 -4.5,2.85; 9 -3.9,2.85; 10 -3.3,2.85; 11 -2.7,2.85; 12 -2.1,2.85; 13 -1.5,2.85; 14 -0.9,2.85; 15 -0.3,2.85; 16 0.3,2.85; 17 0.9,2.85; 18 1.5,2.85; 19 2.1,2.85; 20 2.7,2.85; 21 3.3,2.85; 22 3.9,2.85; 23 4.5,2.85; 24 5.1,2.85; 25 5.7,2.85; 26 6.3,2.85; 27 6.9,2.85; 28 7.5,2.85; 29 8.1,2.85; 30 8.7,2.85; 31 8.7,-2.85; 32 8.1,-2.85; 33 7.5,-2.85; 34 6.9,-2.85; 35 6.3,-2.85; 36 5.7,-2.85; 37 5.1,-2.85; 38 4.5,-2.85; 39 3.9,-2.85; 40 3.3,-2.85; 41 2.7,-2.85; 42 2.1,-2.85; 43 1.5,-2.85; 44 0.9,-2.85; 45 0.3,-2.85; 46 -0.3,-2.85; 47 -0.9,-2.85; 48 -1.5,-2.85; 49 -2.1,-2.85; 50 -2.7,-2.85; 51 -3.3,-2.85; 52 -3.9,-2.85; 53 -4.5,-2.85; 54 -5.1,-2.85; 55 -5.7,-2.85; 56 -6.3,-2.85; 57 -6.9,-2.85; 58 -7.5,-2.85; 59 -8.1,-2.85; 60 -8.7,-2.85 | hole 1.1: -11.1,1.8 | hole 0.7: 11.1,1.8
FX8C-60P-SV = smd 0.35 x 2.45: 1 -8.7,-2.225; 2 -8.1,-2.225; 3 -7.5,-2.225; 4 -6.9,-2.225; 5 -6.3,-2.225; 6 -5.7,-2.225; 7 -5.1,-2.225; 8 -4.5,-2.225; 9 -3.9,-2.225; 10 -3.3,-2.225; 11 -2.7,-2.225; 12 -2.1,-2.225; 13 -1.5,-2.225; 14 -0.9,-2.225; 15 -0.3,-2.225; 16 0.3,-2.225; 17 0.9,-2.225; 18 1.5,-2.225; 19 2.1,-2.225; 20 2.7,-2.225; 21 3.3,-2.225; 22 3.9,-2.225; 23 4.5,-2.225; 24 5.1,-2.225; 25 5.7,-2.225; 26 6.3,-2.225; 27 6.9,-2.225; 28 7.5,-2.225; 29 8.1,-2.225; 30 8.7,-2.225; 31 8.7,2.225; 32 8.1,2.225; 33 7.5,2.225; 34 6.9,2.225; 35 6.3,2.225; 36 5.7,2.225; 37 5.1,2.225; 38 4.5,2.225; 39 3.9,2.225; 40 3.3,2.225; 41 2.7,2.225; 42 2.1,2.225; 43 1.5,2.225; 44 0.9,2.225; 45 0.3,2.225; 46 -0.3,2.225; 47 -0.9,2.225; 48 -1.5,2.225; 49 -2.1,2.225; 50 -2.7,2.225; 51 -3.3,2.225; 52 -3.9,2.225; 53 -4.5,2.225; 54 -5.1,2.225; 55 -5.7,2.225; 56 -6.3,2.225; 57 -6.9,2.225; 58 -7.5,2.225; 59 -8.1,2.225; 60 -8.7,2.225 | hole 1.1: -11.1,-1.5 | hole 0.7: 11.1,-1.5
1X04-1MM-RA = smd 0.6 x 1.35: 1 -1.5,0; 2 -0.5,0; 3 0.5,0; 4 1.5,0 | smd 1.2 x 2: NC1 2.8,-3.675; NC2 -2.8,-3.675
1X03-1MM-RA = smd 0.6 x 1.35: 1 -1,0; 2 0,0; 3 1,0 | smd 1.2 x 2: NC1 2.3,-3.675; NC2 -2.3,-3.675
1X02-1MM-RA = smd 0.6 x 1.35: 1 -0.5,0; 2 0.5,0 | smd 1.2 x 2: NC1 1.8,-3.675; NC2 -1.8,-3.675

### Placement (x,y rotation side)
B1  0,0 0 top
C1  2.86,7.3 180 top
C2  7.3,2.22 90 top
C3  2.22,34.92 0 top
C4  25.08,29.21 270 top
C5  39.37,34.61 180 top
C6  34.92,2.22 90 top
C8  14.61,35.24 180 top
C9  8.89,26.67 270 top
C10  16.35,31.75 270 top
C11  10.79,19.05 90 top
C12  14.61,19.05 90 top
C13  6.35,35.24 180 top
C14  1.91,26.67 270 top
C15  18.26,31.75 270 top
C16  3.81,19.05 90 top
C17  7.3,19.05 90 top
C18  27.3,29.21 90 top
C19  29.21,29.21 90 top
C20  34.92,33.66 0 top
C21  35.24,27.62 0 top
IC1  21.91,33.66 0 top
IC2  12.06,25.08 90 top
IC4  6.35,7.62 270 top
IC5  5.08,25.08 90 top
IC6  28.89,33.66 0 top
L1  12.7,31.43 180 top
L2  5.71,31.43 180 top
R1  39.05,16.83 90 top
R2  12.54,19.05 90 top
R3  9.05,22.23 90 top
R4  9.05,19.05 90 top
R5  5.56,19.05 90 top
R6  2.06,22.38 90 top
R7  2.06,19.05 90 top
R8  31.11,29.21 90 top
R9  35.88,19.37 180 top
R10  32.38,16.83 270 top
R11  23.5,16.83 90 top
R12  20.64,19.37 180 top
R13  16.99,16.83 270 top
R14  26.35,19.37 180 top
R15  29.53,19.37 180 top
U$1  36.35,32.07 180 top
U$2  39.53,30.56 270 top
U$3  35.88,16.19 0 top
U$4  35.88,22.86 0 top
U$5  20.64,16.19 0 top
U$6  27.94,16.19 0 top
U$7  30.16,22.86 0 top
U$8  20.64,22.86 0 top
U$9  25.72,22.86 0 top
X1-BOT  21,7 0 bottom
X1-TOP  21,7 180 top
X2  18.41,36.83 180 top
X3  10.16,36.83 180 top
X4  26.04,36.83 180 top
X5  32.7,36.83 180 top

### Tracks (layer width: path | path; a pad name or v marks a point on that pad's centre or on a via)
3V3_PRO  (via drill 0.33)
  Top 0.254: 8.68,10.58 6.19,8.1 6.19,7.46 5.4,6.67 | 5.4,6.67 IC4.2 4.66,6.67 C1.1 | 5.4,6.67 6.04,6.03 v6.35,6.03
  Top 0.406: R15.1 30.38,16.73 30.16,16.51 | 30.16,16.51 U$6.P$11 | 30.16,16.51 30.48,16.19 v30.48,12.86
  Bottom 0.254: 28.8,2.86 28.8,1.59 28.32,1.11 9.53,1.11 8.57,2.06 8.57,4.13 6.67,6.03 v6.35,6.03
  Bottom 0.406: v30.48,12.86 30.48,4.93 X1-BOT.60
  other vias: 28.2,2.85
  pour Bottom (no thermals): 27.75,6 29.85,6 29.85,2.54 27.75,2.54
  pour Top (no thermals): 27.75,6 29.85,6 29.85,2.54 27.75,2.54
!RST  (via drill 0.33)
  Top 0.254: X1-TOP.27 v14.1,11.11 13.97,11.11 13.97,12.06 v12.7,13.34 | IC4.1 5.39,8.57 v6.03,9.21
  Bottom 0.254: X1-BOT.27 v14.1,11.11 | v6.03,9.21 10.16,13.34 v12.7,13.34
+3V3_SW[1]  (via drill 0.33)
  Top 0.406: U$3.P$11 38.51,16.52 R1.1 39.05,14.61 35.88,11.43 29.69,11.43 v29.37,11.11
  pour Top (no thermals): 28.95,11.5 29.85,11.5 29.85,8 28.95,8
  pour Bottom (no thermals): 28.95,11.5 29.85,11.5 29.85,8 28.95,8
+3V3_SW[2]  (via drill 0.33)
  Top 0.406: U$3.P$14 36.2,18.84 R9.1 v37.78,19.37
  Bottom 0.406: v26.99,11.11 26.99,14.61 28.26,15.88 31.75,15.88 35.24,19.37 v37.78,19.37
  pour Top (no thermals): 26.55,11.5 27.45,11.5 27.45,8 26.55,8
  pour Bottom (no thermals): 26.55,11.5 27.45,11.5 27.45,8 26.55,8
+3V3_SW[3]  (via drill 0.33)  (1 unrouted)
  Top 0.406: U$3.P$1 32.9,17.17 R10.1 | 32.38,17.46 v32.38,18.73
  Bottom 0.406: v24.61,11.11 24.77,11.11 24.77,14.61 28.89,18.73 v32.38,18.73
  pour Top (no thermals): 24.15,11.5 25.05,11.5 25.05,8 24.15,8
  pour Bottom (no thermals): 24.15,11.5 25.05,11.5 25.05,8 24.15,8
+3V3_UNPRO
  Top 0.305: U$1.P$11 U$1.P$12 U$1.P$13 U$1.P$14
  Top 0.406: U$1.P$11 34.35,27.66 C21.1 34.39,26.25 | 34.39,26.25 35.56,25.08 U$4.P$2 | 34.39,26.25 32.48,24.34 U$7.P$4 31.14,25.06 30.8,25.4 30.16,25.4 29.84,25.08 U$7.P$2
AUX1
  Top 0.254: IC2.12 10.44,27.52 C9.1
AUX2
  Top 0.254: IC5.12 3.45,27.52 C14.1
BATT_PROG
  Top 0.254: IC6.12 31.34,34.06 31.75,33.66 31.75,31.43 31.11,30.8 R8.2
BMS_!PGD!  (via drill 0.33)
  Top 0.254: v27.15,31.75 27.39,32 IC6.7 | 19.62,27.88 v20,28.26
  Bottom 0.254: v27.15,31.75 26.83,31.43 24.77,31.43 23.18,29.84 21.59,29.84 v20,28.26
FB1
  Top 0.254: R3.1 9.05,20.64 | 9.05,20.64 R4.2 | IC2.1 10.44,21.18 9.9,20.64 9.05,20.64
FB2  (1 unrouted)
  Top 0.254: 2.06,21.38 2.06,20.64 | 2.06,20.64 R7.2 | IC5.1 3.45,21.18 2.91,20.64 2.06,20.64
GND  (via drill 0.33)
  Top 0.254: U$1.P$9 U$1.P$2
  other vias: 12.34,6.99 29.48,6.99 27,2.85 40.96,6.35 34.92,4.29 37.47,34.61 13.65,21.59 9.84,16.83 6.99,21.27 9.84,39.05 4.13,34.92 8.89,24.61 5.71,24.13 4.76,20.95 12.7,24.13 11.75,20.95 2.06,16.99 1.91,24.61 25.8,2.85 22.2,2.86 21,2.86 14.61,27.3 18.6,11.11 21,11.11 23.4,11.11 25.8,11.11 28.2,11.11 16.2,11.11 29.84,31.43 18.73,39.05 26.04,39.05 32.38,34.77 29.21,36.2 6.35,36.83 14.61,36.83 9.21,31.43 19.37,33.66 21.91,35.88 21.91,31.43 17.46,29.53 35.56,6.35 11.11,3.49 35.56,36.2 6.99,4.45 7.94,6.35 0.95,6.35 18.1,15.56 25.08,16.19 25.88,14.45 34.13,12.86 31.75,14.61 23.81,24.45 33.97,24.45 33.02,26.35
  pour Top (rank 6): 42,42 0,42 0,0 42,0
  pour Bottom (rank 6): 42,42 0,42 0,0 42,0
  pour Bottom (rank 4, no thermals): 10.75,11.75 30.75,11.75 30.75,0.95 10.75,0.95
  pour Top (rank 4, no thermals): 10.75,11.43 30.75,11.43 30.75,0.95 10.75,0.95
  pour Top (rank 4, no thermals): 19.37,31.43 19.37,35.56 24.13,35.56 24.13,31.43
  pour Top (rank 2, no thermals): 15.88,27.3 22.86,27.3 22.86,20.32 15.88,20.32
  pour Top (no thermals): 26.67,35.24 31.11,35.24 31.11,31.75 26.67,31.75
GPIO[0]  (via drill 0.33)
  Top 0.254: X1-TOP.25 v15.3,11.11
  Bottom 0.254: v15.3,11.11 X1-BOT.25
GPIO[1]  (via drill 0.33)
  Top 0.254: X1-TOP.26 v14.7,11.75
  Bottom 0.254: v14.7,11.75 X1-BOT.26
GPIO[2]  (via drill 0.33)
  Top 0.254: X1-TOP.34 v14.1,2.22
  Bottom 0.254: v14.1,2.22 X1-BOT.34
GPIO[3]  (via drill 0.33)
  Top 0.254: v14.7,2.86 X1-TOP.35
  Bottom 0.254: X1-BOT.35 v14.7,2.86
GPIO[4]  (via drill 0.33)
  Top 0.254: X1-TOP.36 v15.3,2.22
  Bottom 0.254: v15.3,2.22 X1-BOT.36
GPIO[5]  (via drill 0.33)
  Top 0.254: v15.9,2.86 X1-TOP.37
  Bottom 0.254: X1-BOT.37 v15.9,2.86
GPIO[6]  (via drill 0.33)
  Top 0.254: v16.5,2.22 X1-TOP.38
  Bottom 0.254: X1-BOT.38 v16.5,2.22
GPIO[7]  (via drill 0.33)
  Top 0.254: X1-TOP.39 v17.1,2.86 arc-90 v17.1,2.86
  Bottom 0.254: v17.1,2.86 X1-BOT.39 arc-90 X1-BOT.39
GPIO[8]  (via drill 0.33)
  Top 0.254: v17.7,2.22 X1-TOP.40
  Bottom 0.254: X1-BOT.40 v17.7,2.22
GPIO[9]  (via drill 0.33)
  Top 0.254: X1-TOP.41 v18.3,2.86
  Bottom 0.254: v18.3,2.86 X1-BOT.41
GPIO[10]  (via drill 0.33)
  Top 0.254: v18.9,2.22 X1-TOP.42
  Bottom 0.254: X1-BOT.42 v18.9,2.22
GPIO[11]  (via drill 0.33)
  Top 0.254: X1-TOP.43 v19.5,2.86
  Bottom 0.254: v19.5,2.86 X1-BOT.43
GPIO[12]  (via drill 0.33)
  Top 0.254: X1-TOP.44 v20.1,2.22
  Bottom 0.254: v20.1,2.22 X1-BOT.44
I2C_SCL  (via drill 0.33)
  Top 0.254: X1-TOP.29 v12.9,11.11 10.72,13.29 | 18.12,27.6 17.78,27.94 16.52,27.94 14.61,26.03 14.61,22.23 v14.45,22.07 | U$6.P$6 27.61,13.82 v27.78,13.65 | v35.56,13.65 U$3.P$6 | v27.94,11.91 26.99,11.91 26.04,12.86 20.8,12.86 20.31,13.34 U$5.P$6 U$5.P$5 19.51,14.29 v15.88,14.29
  Top 0.305: U$3.P$6
  Bottom 0.254: X1-BOT.29 v12.9,11.11 12.9,11.95 15.08,14.13 15.08,14.29 | v14.45,22.07 15.08,21.43 15.08,14.29 | v35.56,13.65 v27.78,13.65 27.78,12.86 27.94,12.7 v27.94,11.91 | 15.08,14.29 v15.88,14.29
I2C_SDA  (via drill 0.33)
  Top 0.254: X1-TOP.30 12.3,10.79 v11.98,11.11 11.71,11.38 | 17.61,27.31 17.46,27.46 16.67,27.46 15.08,25.88 15.08,21.91 v14.45,21.27 | U$6.P$7 28.27,14.12 28.57,13.81 28.57,13.34 28.26,13.02 | 28.26,13.02 27.3,13.02 26.99,13.34 26.99,13.65 | 26.99,13.65 26.99,14.42 | U$3.P$7 36.2,13.34 34.92,12.06 29.53,12.06 28.57,13.02 28.26,13.02 | 26.99,13.65 v20.95,13.65 U$5.P$7 | v13.65,14.29 15.72,12.22 v20.95,12.22
  Top 0.305: 26.99,14.42 U$6.P$5 | U$5.P$7
  Bottom 0.254: X1-BOT.30 12.3,10.79 v11.98,11.11 12.38,11.51 12.38,12.06 14.13,13.81 | v14.45,21.27 14.61,21.11 14.61,14.29 14.13,13.81 | v13.65,14.29 14.13,13.81 | v20.95,12.22 v20.95,13.65
IDIODE_STAT  (via drill 0.33)
  Top 0.254: IC1.9 23.94,34.16 v24.45,33.66 | 18.61,28.07 v18.41,28.26
  Bottom 0.254: v24.45,33.66 24.45,32.38 22.86,30.8 20.95,30.8 v18.41,28.26
L1
  pour Top (no thermals): 34.61,30.8 41.59,30.8 41.59,32.7 37.47,32.7 36.2,31.43 34.61,31.43
L2
  pour Top (no thermals): 34.61,29.69 36.2,29.69 37.47,28.42 41.59,28.42 41.59,30.32 34.61,30.32
LDO1
  Top 0.254: IC2.2 11.1,20.94 10.79,20.64 C11.2
LDO2
  Top 0.254: IC5.2 4.12,20.95 3.81,20.65 C16.2
MPPC1
  Top 0.254: IC2.5 13.03,21.13 12.54,20.64 R2.2
MPPC2
  Top 0.254: IC5.5 6.04,21.11 5.56,20.62 R5.2
MPPT2:THM
  Top 0.406: 7.3,18.2 5.56,18.2
MPPT_PGD  (via drill 0.33)
  Top 0.254: v7.62,24.92 7.62,26.19 7.94,26.51 7.94,28.1 8.41,28.57 9.84,28.57 10.16,28.26 11.59,28.26 11.73,28.11 IC2.10 | 4.75,25.41 v5.08,25.08 | 16.38,25.06 16.19,25.24 16.19,26.04 v16.35,26.19
  Bottom 0.254: v16.35,26.19 14.29,24.13 14.29,23.18 13.97,22.86 7.94,22.86 7.62,23.18 v7.62,24.92 7.46,25.08 v5.08,25.08
N$1
  Top 0.254: B1.1 6.03,1.59 C2.1
N$2
  Top 0.254: B1.2 1.59,36.04 C3.1
N$3
  Top 0.254: B1.3 40.01,35.88 C5.1
N$4
  Top 0.254: B1.4 36.2,1.59 36.18,1.57 C6.1
N$6
  Top 0.406: U$3.P$12 38.54,17.17 R1.2 39.05,19.37 38.1,20.32 36.51,20.32 36.2,20.63 U$4.P$6
N$7
  Top 0.406: U$3.P$15 35.55,18.84 R9.2 35.55,19.89 U$4.P$7
N$8
  Top 0.406: U$3.P$2 32.92,16.52 R10.2 31.43,16.93 31.43,20 31.11,20.32 30.8,20.32 30.49,20.63 U$7.P$6
N$9
  Top 0.406: U$5.P$12 22.98,17.17 R11.2 23.5,19.05 22.23,20.32 21.27,20.32 20.96,20.63 U$8.P$6
N$10
  Top 0.406: U$8.P$7 20.31,19.89 R12.2 20.31,18.84 U$5.P$15
N$11  (via drill 0.33)
  Top 0.406: 17.53,16.52 R13.2 | U$9.P$6 26.04,20.63 26.35,20.32 26.99,20.32 27.94,21.27 v27.94,21.91 | U$5.P$2 17.53,16.52 | 17.53,16.52 v15.88,16.52 v15.88,16.51
  Bottom 0.406: v15.88,16.51 15.88,18.1 17.46,19.68 25.72,19.68 v27.94,21.91
N$12
  Top 0.406: U$6.P$2 25.72,16.51 25.5,16.73 R14.2 25.39,19.57 U$9.P$7
N$13
  Top 0.406: U$6.P$12 29.69,18.36 R15.2 29.84,20.53 U$7.P$7
S_ARRAY_1  (via drill 0.33)
  Top 0.406: IC1.1 19.65,34.65 v19.37,34.92 19.05,34.61 17.46,34.61 16.35,33.5 16.35,32.86 16.51,32.7 16.25,32.7 | IC2.11 v11.1,25.7 9.05,23.65 R3.2 | C10.1 16.25,32.7 | 16.25,32.7 16.19,32.7
  Bottom 0.406: v11.1,25.7 13.98,25.7 15.56,27.29 15.56,32.7 17.46,34.61 19.05,34.61 v19.37,34.92
S_ARRAY_2  (via drill 0.33)  (1 unrouted)
  Top 0.406: 2.06,23.65 v4.12,25.7 IC5.11 | IC1.5 19.65,32.66 v19.37,32.38 | v19.37,32.38 19.15,32.6 | C15.1 18.36,32.7 19.05,32.7 v19.37,32.38
  Bottom 0.406: v4.12,25.7 10.15,25.7 10.95,24.92 14.12,24.92 16.19,26.99 16.19,32.38 16.51,32.7 19.05,32.7 v19.37,32.38
SOLAR[1..2]
  Top 0.406: X2.2 18.91,35.74 18.73,35.56 17.14,35.56 16.91,35.79 | X2.4 16.91,35.79 | 16.91,35.79 16.37,35.24 C8.1 15.46,34.19 14.29,33.02 14.29,31.68 L1.1 14.06,28.89 13.34,28.89 13.03,28.59 IC2.8
SOLAR[3..4]
  Top 0.406: X3.4 8.66,35.79 | 8.66,35.79 8.89,35.56 10.48,35.56 10.66,35.74 X3.2 | 8.66,35.79 8.11,35.24 C13.1 7.2,31.58 L2.1 7.07,28.89 6.35,28.89 6.04,28.59 IC5.8
SPI_MISO  (via drill 0.33)
  Top 0.254: X1-TOP.32 v12.9,2.22
  Bottom 0.254: v12.9,2.22 X1-BOT.32
SPI_MOSI  (via drill 0.33)
  Top 0.254: X1-TOP.31 v12.3,2.86
  Bottom 0.254: X1-BOT.31 v12.3,2.86
SPI_SCK  (via drill 0.33)
  Top 0.254: X1-TOP.33 v13.5,2.86
  Bottom 0.254: v13.5,2.86 X1-BOT.33
SW1
  Top 0.406: IC2.9 12.39,28.56 12.06,28.89 11.43,28.89 11.34,28.98 L1.2
SW2
  Top 0.406: IC5.9 5.41,28.56 5.08,28.89 4.45,28.89 4.36,28.98 L2.2
THM  (via drill 0.33)
  Top 0.254: v26.35,33.02 26.58,33.25 IC6.5 | v26.04,35.56 X4.2
  Bottom 0.254: v26.35,33.02 26.35,35.24 v26.04,35.56
THM1
  Top 0.406: C12.1 R2.1
THM2  (1 unrouted)
V_BAT
  Top 0.254: IC6.1 27.39,34.65 IC6.2
  Top 0.406: X4.3 25.04,35.29 25.68,34.65 27.39,34.65
VBAT  (via drill 0.33)  (1 unrouted)
  Top 0.406: R14.1 26.19,18.36 U$6.P$1 | X1-TOP.52 24.9,2.09 25.4,1.59 29.84,1.59 40.64,12.38 40.64,19.05 v39.05,20.64 | 27.3,19.37 27.3,19.68 28.26,20.64 v28.57,20.64
  Bottom 0.406: v39.05,20.64 v28.57,20.64
  other vias: 24.6,2.85 23.4,2.85
  pour Bottom (no thermals): 22.96,6 25.05,6 25.05,2.54 22.96,2.54
  pour Top (no thermals): 22.96,6 25.05,6 25.05,2.54 22.96,2.54
VBAT_SW[1]  (via drill 0.33)
  Top 0.406: U$5.P$11 22.95,16.52 R11.1 v23.5,14.61
  Bottom 0.406: v22.23,11.11 22.23,13.34 v23.5,14.61
  pour Top (no thermals): 21.75,11.5 22.65,11.5 22.65,8 21.75,8
  pour Bottom (no thermals): 21.75,11.5 22.65,11.5 22.65,8 21.75,8
VBAT_SW[2]  (via drill 0.33)  (1 unrouted)
  Top 0.406: U$5.P$14 20.96,18.84 R12.1 | 21.27,19.37 21.59,19.37 v22.54,18.73
  Bottom 0.406: v19.84,11.11 19.84,16.03 v22.54,18.73
  pour Bottom (no thermals): 19.35,11.5 20.25,11.5 20.25,8 19.35,8
  pour Top (no thermals): 19.35,11.5 20.25,11.5 20.25,8 19.35,8
VBAT_SW[3]  (via drill 0.33)  (1 unrouted)
  Top 0.406: U$5.P$1 17.5,17.17 R13.1 | 17.14,17.78 18.1,17.78 v18.41,18.1
  Bottom 0.406: v17.46,11.11 17.14,11.43 17.14,16.83 v18.41,18.1
  pour Top (no thermals): 16.95,11.5 17.85,11.5 17.85,8 16.95,8
  pour Bottom (no thermals): 16.95,11.5 17.85,11.5 17.85,8 16.95,8
VL
  Top 0.254: IC6.4 25.88,33.66 25.56,33.34 25.56,31.59 26.04,31.11 28.89,31.11 29.21,30.8 C19.2
VSOL  (1 unrouted)
  Top 0.254: 25.49,34.06 IC6.3
  Top 0.305: 27.2,30.16 C4.1 25.08,32.31 24.73,32.66 | IC1.10 24.91,34.65 25.49,34.06 25.08,33.66 25.08,33.02 24.73,32.66 | IC1.6 24.73,32.66
VSYS
  Top 0.254: IC6.14 30.39,34.61 IC6.13
  Top 0.406: X5.2 32.2,35.7 31.11,34.61 30.39,34.61
VSYS_SW  (via drill 0.33)
  Top 0.254: U$1.P$8 34.35,31.07 U$1.P$7 U$1.P$6 U$1.P$5 U$1.P$4 | U$5.P$4 18.71,15.22 18.41,14.92 16.51,14.92 15.24,16.19 15.24,16.83 15.56,17.14 15.56,18.1 v18.1,20.64 | v22.86,20.64 22.86,20.48 24.45,18.89 24.45,15.56 24.77,15.24 26.17,15.24 U$6.P$4 | v33.34,21.91 v33.34,19.68 | v33.34,14.45 33.83,14.92 U$3.P$4 | v27.62,25.08 26.99,25.72
  Top 0.406: X5.1 33.2,34.53 C20.1 34.08,32.25 U$1.P$7 | U$1.P$8 32.97,31.07 32.7,30.8 32.7,27.62 31.43,26.35 27.62,26.35 26.99,25.72 26.67,25.4 | U$9.P$4 26.67,24.36 26.67,25.4 | 26.67,25.4 25.72,25.4 | 25.72,25.4 25.4,25.08 U$9.P$2 | U$8.P$2 20.31,25.07 20.64,25.4 25.72,25.4
  Bottom 0.254: v18.1,20.64 v22.86,20.64 25.4,20.64 27.3,22.54 | 27.3,22.54 32.7,22.54 v33.34,21.91 | v33.34,19.68 v33.34,14.45 | 27.3,22.54 27.62,22.86 v27.62,25.08

### Text on the board
Top: Top
Bottom: Bot
tPlace: ISSUE A | PQ60-EPS